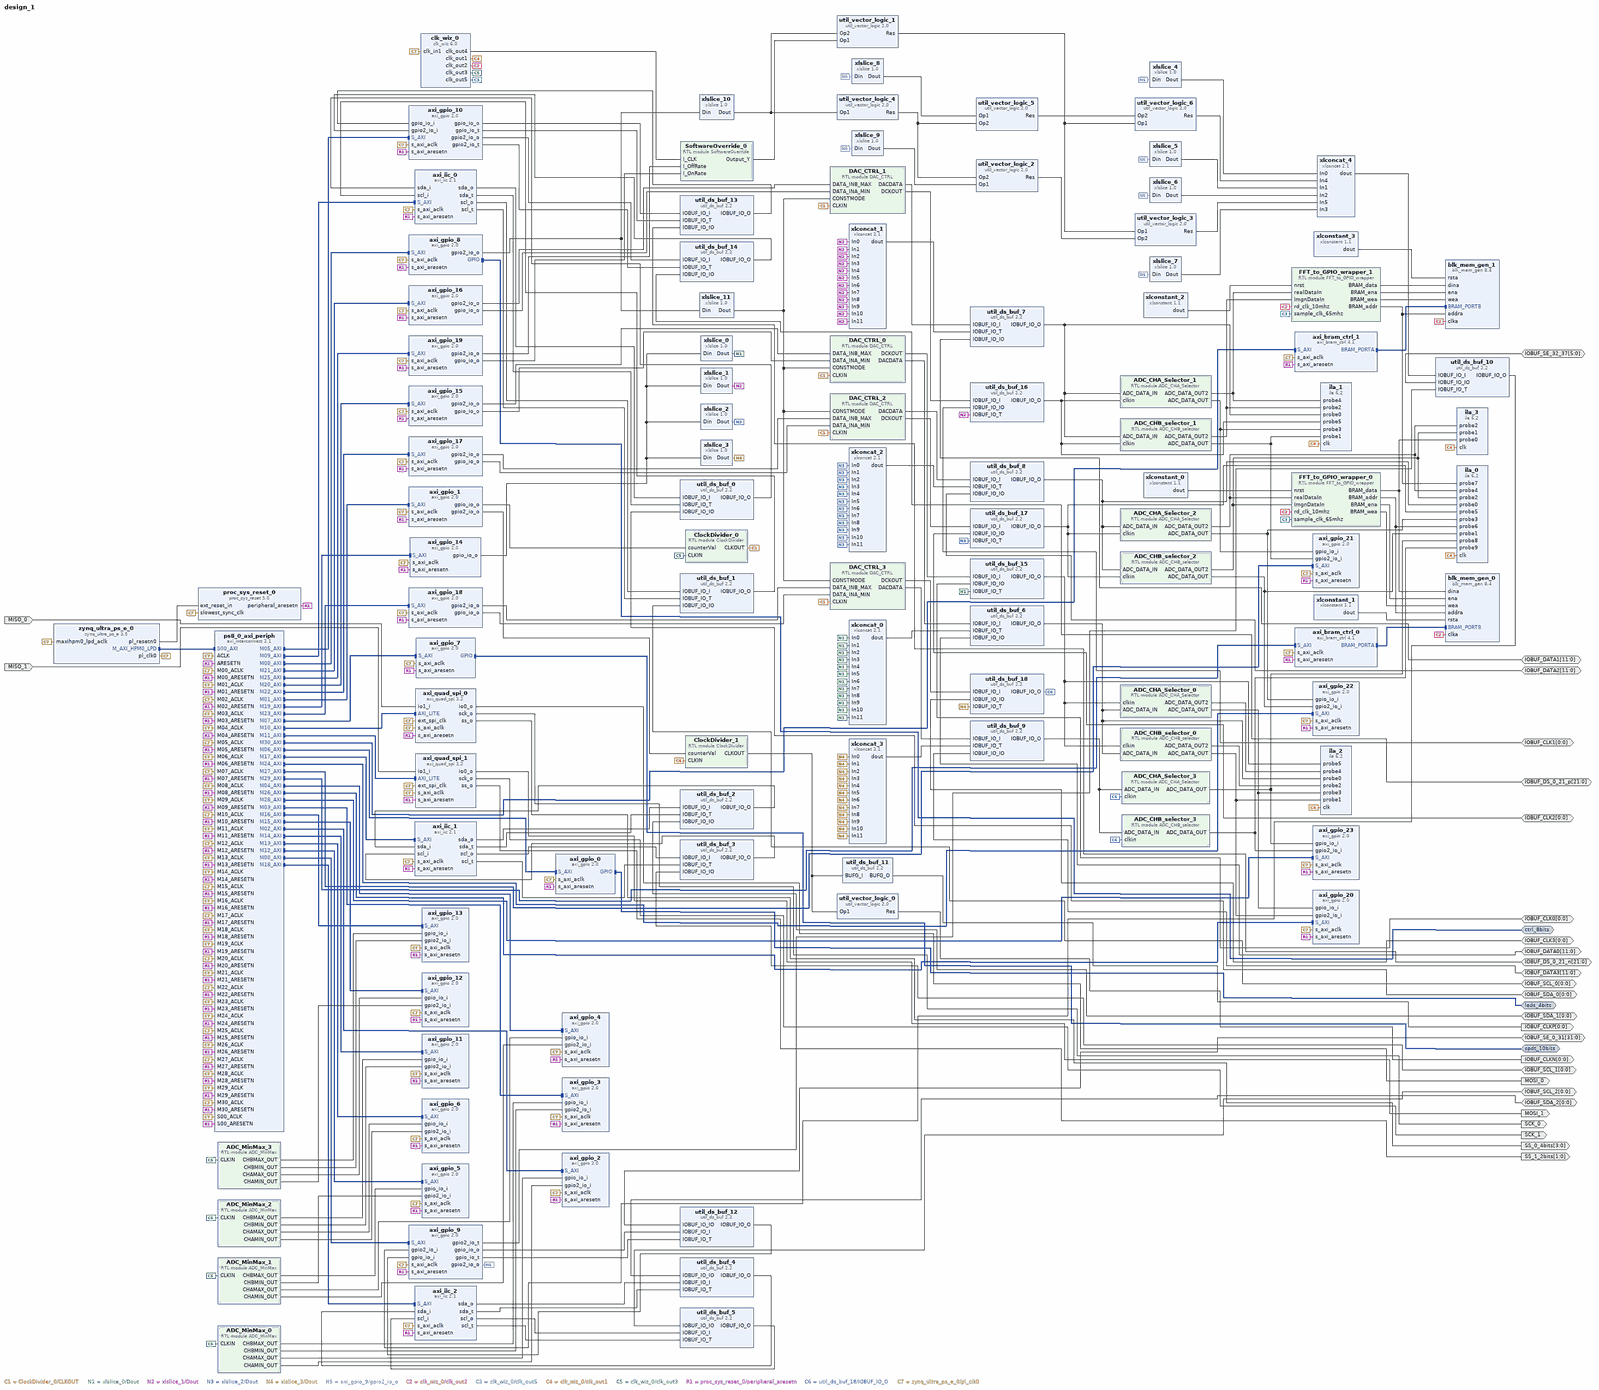
[diagram p0: block diagram of the top level, whole]
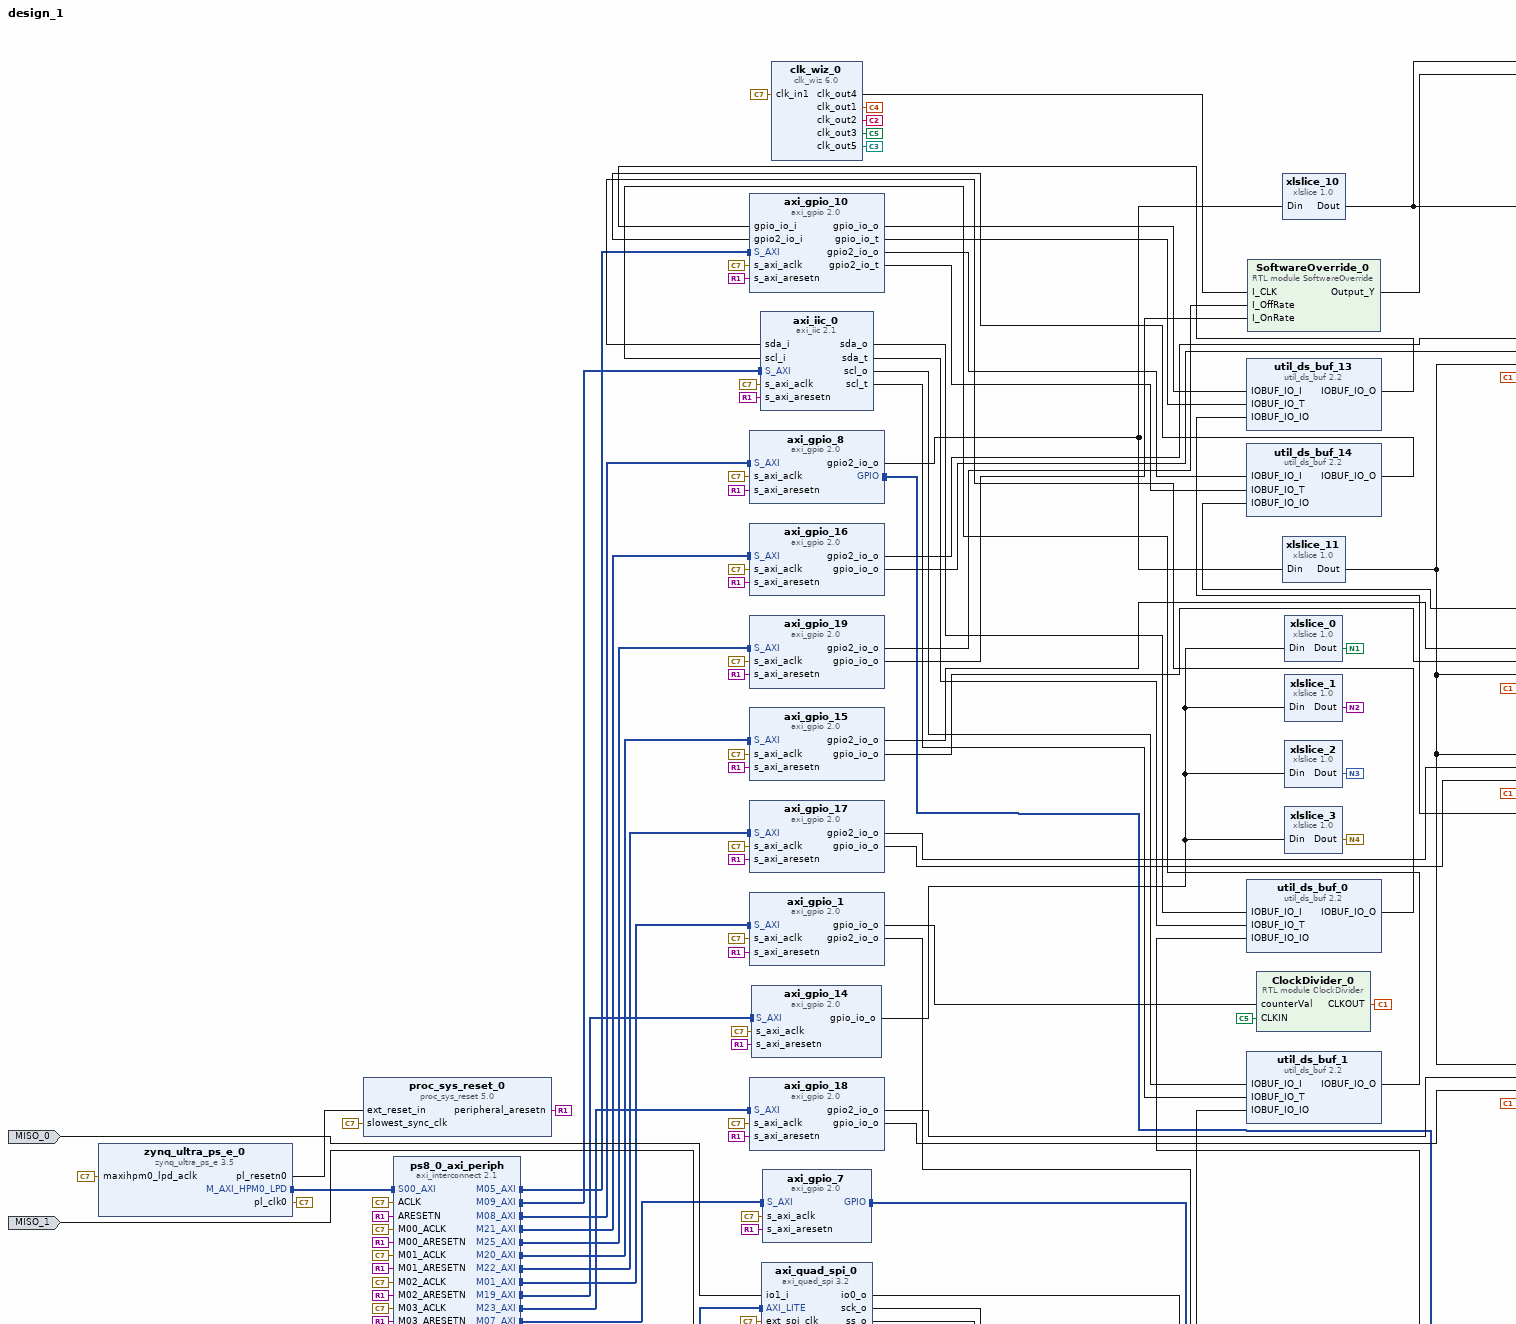
[diagram p1: block diagram of the top level, upper left part]
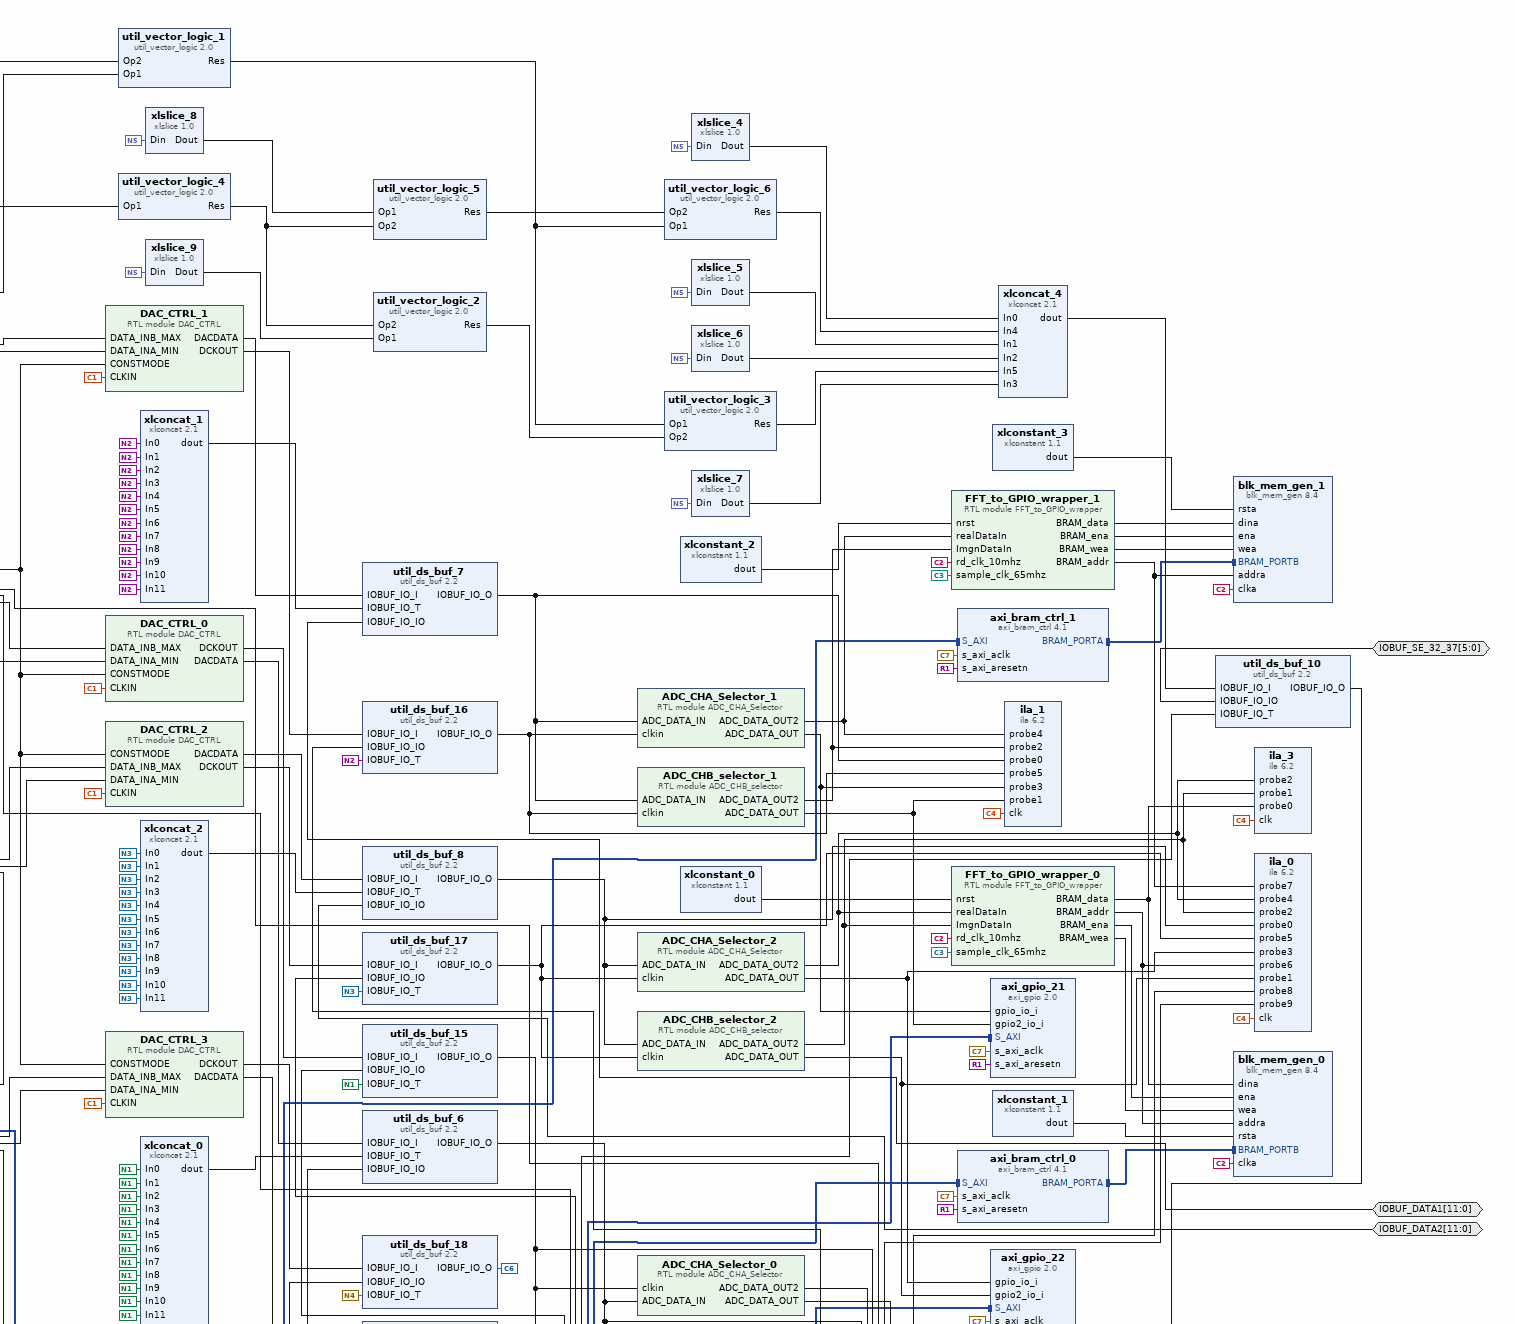
[diagram p2: block diagram of the top level, upper right part]
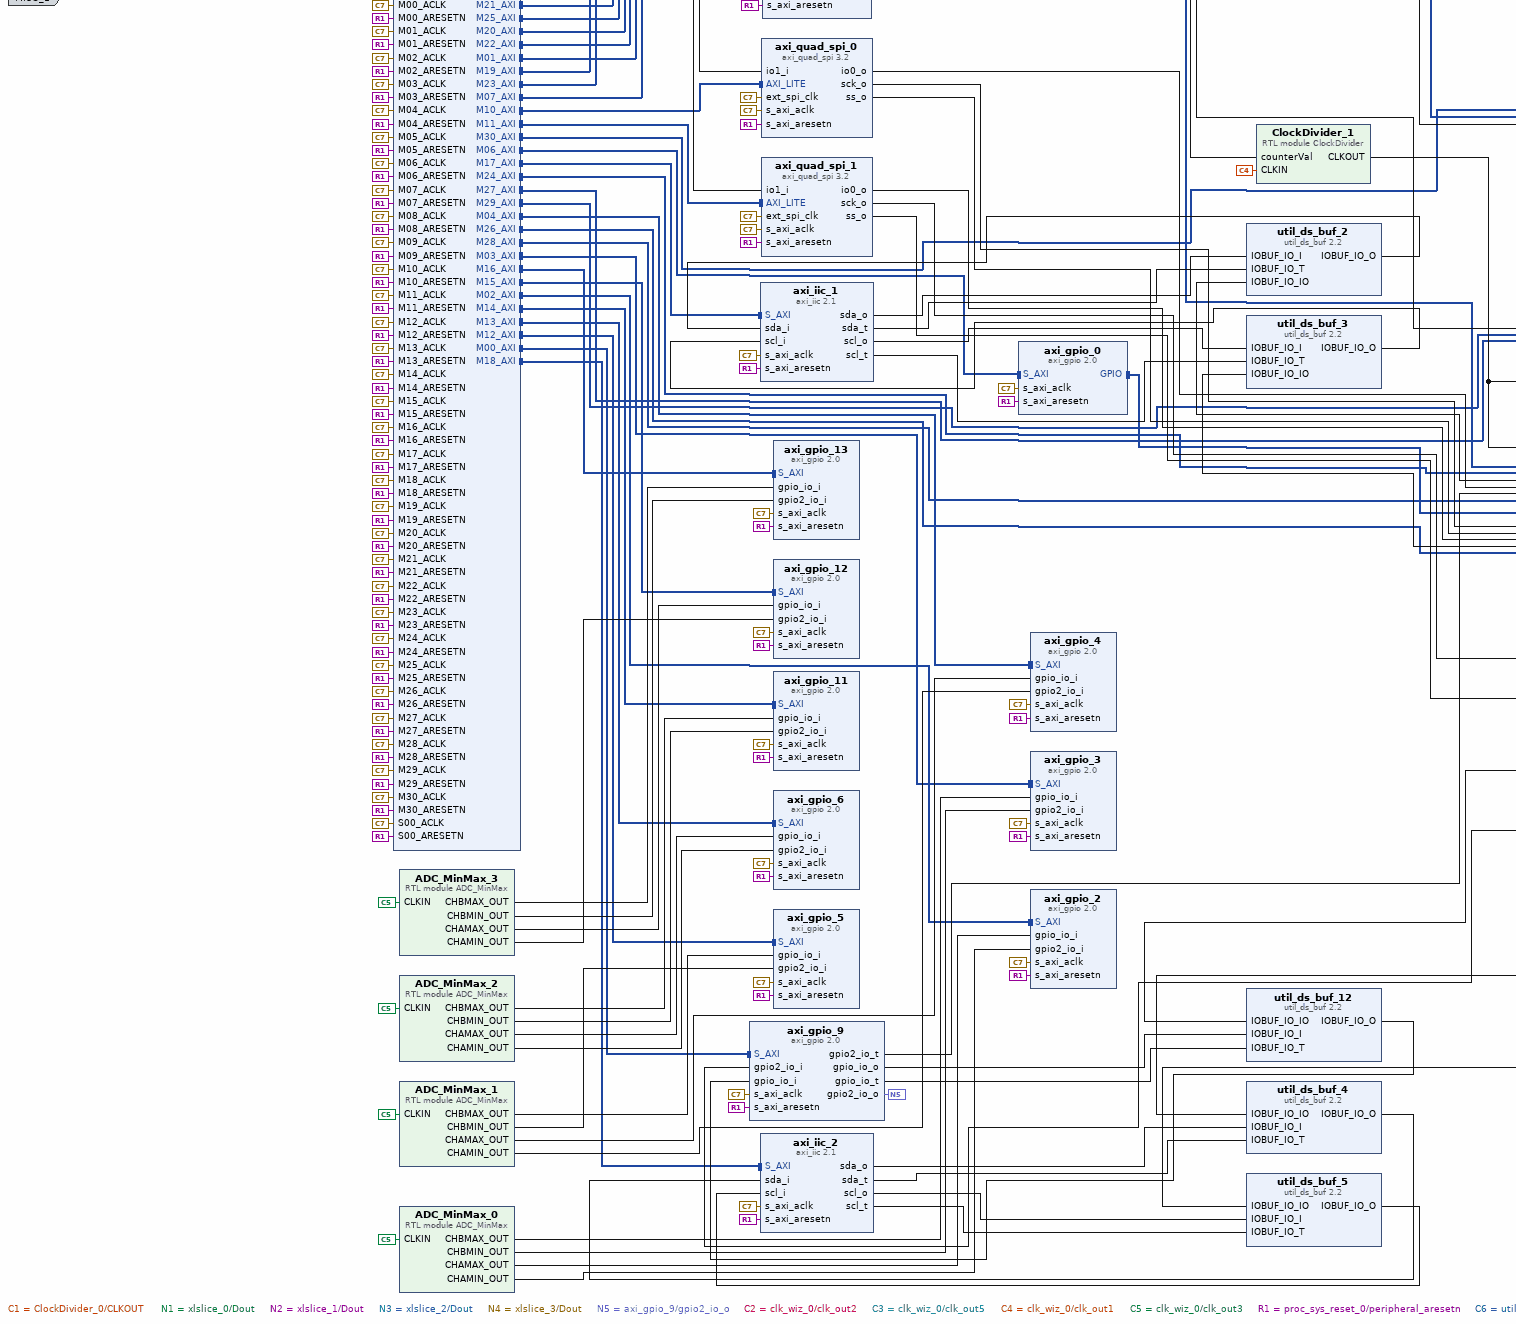
[diagram p3: block diagram of the top level, lower left part]
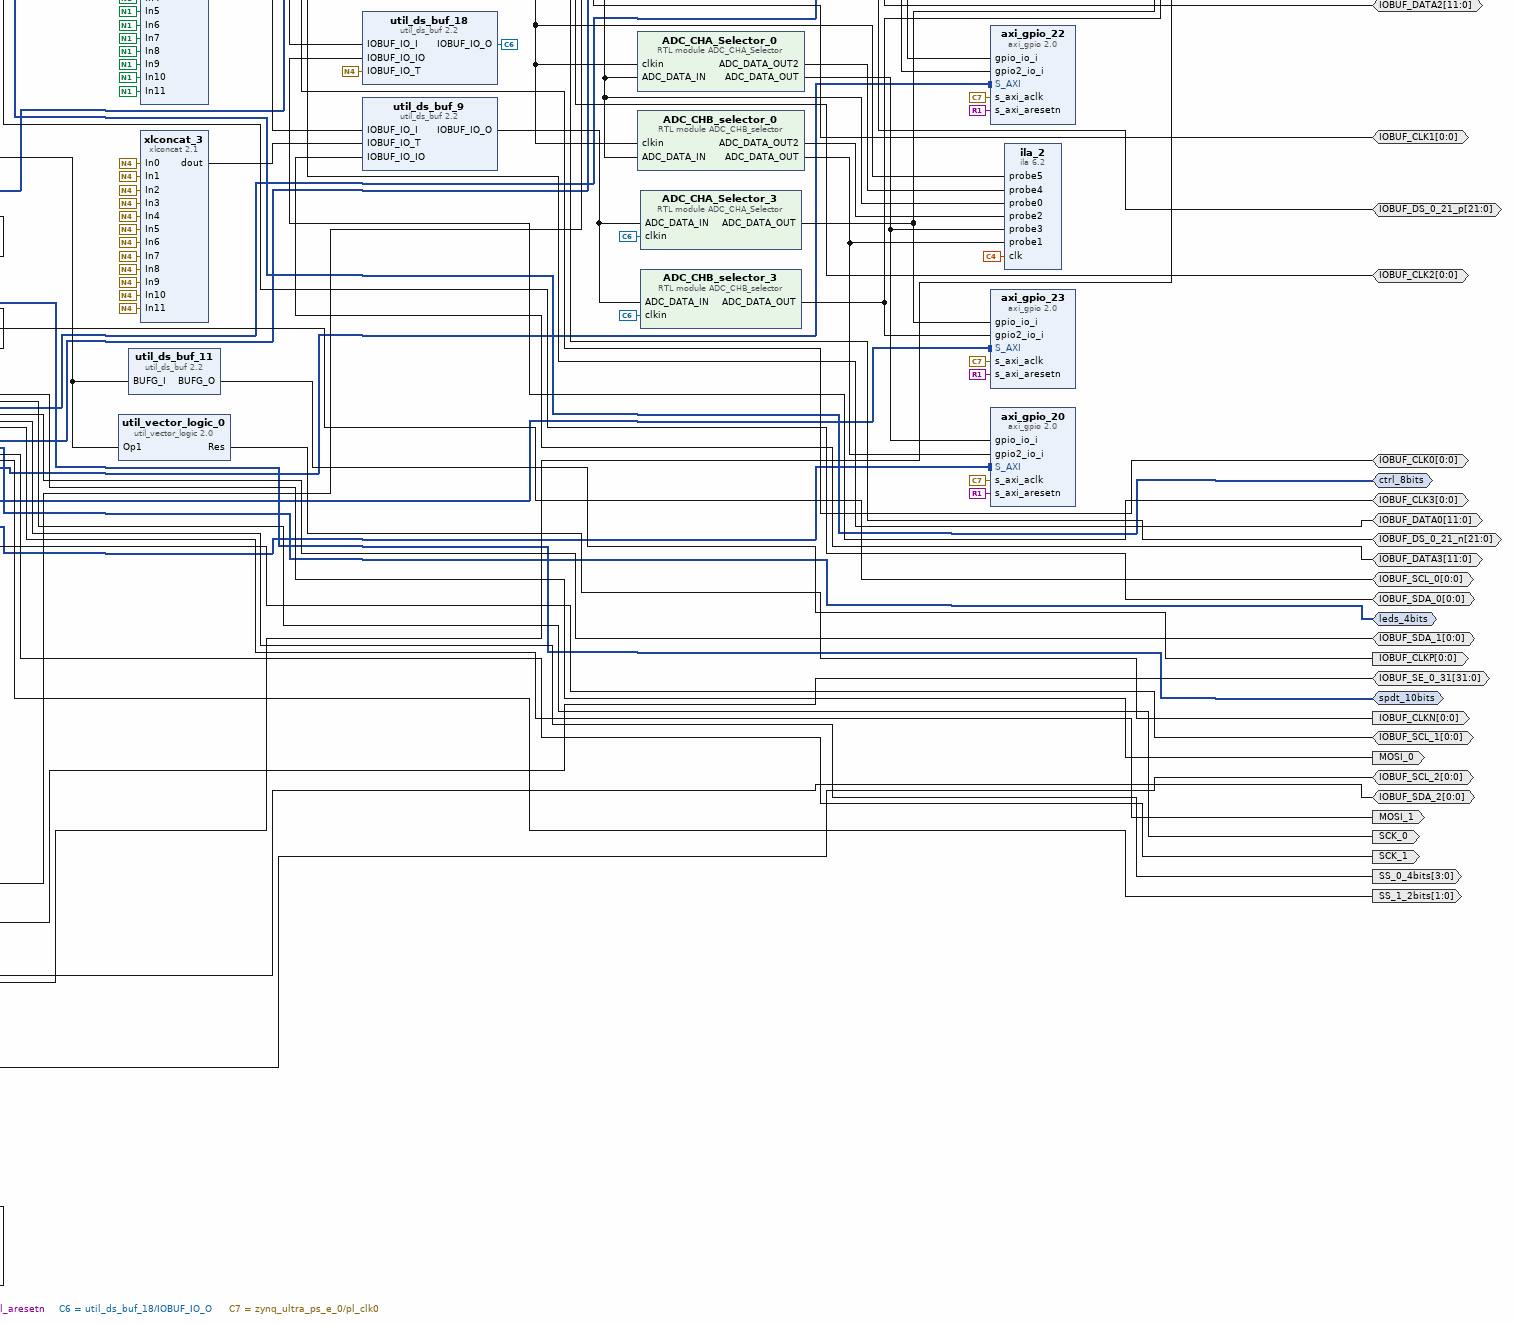
[diagram p4: block diagram of the top level, lower right part]
# Vivado block design design_1, xczu3eg-sfvc784-1-e, Vivado 2023.1
create_bd_design design_1

create_bd_intf_port -mode Master -vlnv xilinx.com:interface:gpio_rtl:1.0 ctrl_8bits
create_bd_intf_port -mode Master -vlnv xilinx.com:interface:gpio_rtl:1.0 leds_4bits
create_bd_intf_port -mode Master -vlnv xilinx.com:interface:gpio_rtl:1.0 spdt_10bits
create_bd_port -dir IO -from 5 -to 0 IOBUF_SE_32_37
create_bd_port -dir IO -from 31 -to 0 IOBUF_SE_0_31
create_bd_port -dir IO -from 21 -to 0 IOBUF_DS_0_21_p
create_bd_port -dir IO -from 21 -to 0 IOBUF_DS_0_21_n
create_bd_port -dir IO -from 0 -to 0 IOBUF_SDA_0
create_bd_port -dir IO -from 0 -to 0 IOBUF_SCL_0
create_bd_port -dir O MOSI_0
create_bd_port -dir I MISO_0
create_bd_port -dir O SCK_0
create_bd_port -dir O -from 3 -to 0 SS_0_4bits
create_bd_port -dir O MOSI_1
create_bd_port -dir I MISO_1
create_bd_port -dir O SCK_1
create_bd_port -dir O -from 1 -to 0 SS_1_2bits
create_bd_port -dir O -from 0 -to 0 IOBUF_CLKN
create_bd_port -dir O -from 0 -to 0 -type clk IOBUF_CLKP
create_bd_port -dir IO -from 0 -to 0 IOBUF_SCL_1
create_bd_port -dir IO -from 0 -to 0 IOBUF_SDA_1
create_bd_port -dir IO -from 0 -to 0 IOBUF_SCL_2
create_bd_port -dir IO -from 0 -to 0 IOBUF_SDA_2
create_bd_port -dir IO -from 0 -to 0 IOBUF_CLK3
create_bd_port -dir IO -from 11 -to 0 IOBUF_DATA1
create_bd_port -dir IO -from 0 -to 0 IOBUF_CLK2
create_bd_port -dir IO -from 0 -to 0 IOBUF_CLK1
create_bd_port -dir IO -from 11 -to 0 IOBUF_DATA2
create_bd_port -dir IO -from 11 -to 0 IOBUF_DATA3
create_bd_port -dir IO -from 0 -to 0 IOBUF_CLK0
create_bd_port -dir IO -from 11 -to 0 IOBUF_DATA0

create_bd_cell -type ip -vlnv xilinx.com:ip:axi_interconnect:2.1 ps8_0_axi_periph
set_property -dict {CONFIG.NUM_MI 31} [get_bd_cells ps8_0_axi_periph]
create_bd_cell -type ip -vlnv xilinx.com:ip:util_vector_logic:2.0 util_vector_logic_0
set_property -dict {CONFIG.C_OPERATION not CONFIG.C_SIZE 1} [get_bd_cells util_vector_logic_0]
create_bd_cell -type ip -vlnv xilinx.com:ip:axi_gpio:2.0 axi_gpio_9
set_property -dict {CONFIG.C_GPIO2_WIDTH 6 CONFIG.C_IS_DUAL 1} [get_bd_cells axi_gpio_9]
create_bd_cell -type ip -vlnv xilinx.com:ip:axi_gpio:2.0 axi_gpio_0
set_property -dict {CONFIG.C_ALL_OUTPUTS 1 CONFIG.C_GPIO_WIDTH 4} [get_bd_cells axi_gpio_0]
create_bd_cell -type ip -vlnv xilinx.com:ip:axi_gpio:2.0 axi_gpio_8
set_property -dict [list \
  CONFIG.C_ALL_OUTPUTS 1 \
  CONFIG.C_ALL_OUTPUTS_2 1 \
  CONFIG.C_GPIO2_WIDTH 2 \
  CONFIG.C_GPIO_WIDTH 8 \
  CONFIG.C_IS_DUAL 1 \
] [get_bd_cells axi_gpio_8]
create_bd_cell -type ip -vlnv xilinx.com:ip:axi_gpio:2.0 axi_gpio_7
set_property -dict {CONFIG.C_ALL_OUTPUTS 1 CONFIG.C_GPIO_WIDTH 10} [get_bd_cells axi_gpio_7]
create_bd_cell -type ip -vlnv xilinx.com:ip:axi_gpio:2.0 axi_gpio_10
set_property -dict {CONFIG.C_GPIO2_WIDTH 22 CONFIG.C_GPIO_WIDTH 22 CONFIG.C_IS_DUAL 1} [get_bd_cells axi_gpio_10]
create_bd_cell -type ip -vlnv xilinx.com:ip:axi_iic:2.1 axi_iic_0
create_bd_cell -type ip -vlnv xilinx.com:ip:axi_quad_spi:3.2 axi_quad_spi_0
set_property -dict {CONFIG.C_NUM_SS_BITS 4 CONFIG.Multiples16 32} [get_bd_cells axi_quad_spi_0]
create_bd_cell -type ip -vlnv xilinx.com:ip:axi_quad_spi:3.2 axi_quad_spi_1
set_property -dict {CONFIG.C_NUM_SS_BITS 2 CONFIG.C_SCK_RATIO 8} [get_bd_cells axi_quad_spi_1]
create_bd_cell -type ip -vlnv xilinx.com:ip:proc_sys_reset:5.0 proc_sys_reset_0
create_bd_cell -type ip -vlnv xilinx.com:ip:util_ds_buf:2.2 util_ds_buf_10
set_property -dict {CONFIG.C_BUF_TYPE IOBUF CONFIG.C_SIZE 6} [get_bd_cells util_ds_buf_10]
create_bd_cell -type ip -vlnv xilinx.com:ip:util_ds_buf:2.2 util_ds_buf_12
set_property -dict {CONFIG.C_BUF_TYPE IOBUF CONFIG.C_SIZE 32} [get_bd_cells util_ds_buf_12]
create_bd_cell -type ip -vlnv xilinx.com:ip:util_ds_buf:2.2 util_ds_buf_14
set_property -dict {CONFIG.C_BUF_TYPE IOBUF CONFIG.C_SIZE 22} [get_bd_cells util_ds_buf_14]
create_bd_cell -type ip -vlnv xilinx.com:ip:util_ds_buf:2.2 util_ds_buf_0
set_property -dict {CONFIG.C_BUF_TYPE IOBUF CONFIG.C_SIZE 1} [get_bd_cells util_ds_buf_0]
create_bd_cell -type ip -vlnv xilinx.com:ip:util_ds_buf:2.2 util_ds_buf_1
set_property -dict {CONFIG.C_BUF_TYPE IOBUF CONFIG.C_SIZE 1} [get_bd_cells util_ds_buf_1]
create_bd_cell -type ip -vlnv xilinx.com:ip:util_ds_buf:2.2 util_ds_buf_13
set_property -dict {CONFIG.C_BUF_TYPE IOBUF CONFIG.C_SIZE 22} [get_bd_cells util_ds_buf_13]
create_bd_cell -type ip -vlnv xilinx.com:ip:zynq_ultra_ps_e:3.5 zynq_ultra_ps_e_0
set_property -dict [list \
  CONFIG.CAN0_BOARD_INTERFACE custom \
  CONFIG.CAN1_BOARD_INTERFACE custom \
  CONFIG.CSU_BOARD_INTERFACE custom \
  CONFIG.DP_BOARD_INTERFACE custom \
  CONFIG.GEM0_BOARD_INTERFACE custom \
  CONFIG.GEM1_BOARD_INTERFACE custom \
  CONFIG.GEM2_BOARD_INTERFACE custom \
  CONFIG.GEM3_BOARD_INTERFACE custom \
  CONFIG.GPIO_BOARD_INTERFACE custom \
  CONFIG.IIC0_BOARD_INTERFACE custom \
  CONFIG.IIC1_BOARD_INTERFACE custom \
  CONFIG.NAND_BOARD_INTERFACE custom \
  CONFIG.PCIE_BOARD_INTERFACE custom \
  CONFIG.PJTAG_BOARD_INTERFACE custom \
  CONFIG.PMU_BOARD_INTERFACE custom \
  CONFIG.PSU_BANK_0_IO_STANDARD LVCMOS18 \
  CONFIG.PSU_BANK_1_IO_STANDARD LVCMOS18 \
  CONFIG.PSU_BANK_2_IO_STANDARD LVCMOS18 \
  CONFIG.PSU_BANK_3_IO_STANDARD LVCMOS18 \
  CONFIG.PSU_USB3__DUAL_CLOCK_ENABLE 0 \
  CONFIG.PSU__CAN1__PERIPHERAL__ENABLE 0 \
  CONFIG.PSU__CRF_APB__ACPU_CTRL__FREQMHZ 1100 \
  CONFIG.PSU__CRF_APB__ACPU_CTRL__SRCSEL APLL \
  CONFIG.PSU__CRF_APB__APLL_CTRL__SRCSEL PSS_REF_CLK \
  CONFIG.PSU__CRF_APB__DBG_FPD_CTRL__FREQMHZ 250 \
  CONFIG.PSU__CRF_APB__DBG_FPD_CTRL__SRCSEL IOPLL \
  CONFIG.PSU__CRF_APB__DBG_TRACE_CTRL__FREQMHZ 250 \
  CONFIG.PSU__CRF_APB__DBG_TRACE_CTRL__SRCSEL IOPLL \
  CONFIG.PSU__CRF_APB__DBG_TSTMP_CTRL__FREQMHZ 250 \
  CONFIG.PSU__CRF_APB__DBG_TSTMP_CTRL__SRCSEL IOPLL \
  CONFIG.PSU__CRF_APB__DDR_CTRL__FREQMHZ 534 \
  CONFIG.PSU__CRF_APB__DDR_CTRL__SRCSEL DPLL \
  CONFIG.PSU__CRF_APB__DPDMA_REF_CTRL__FREQMHZ 550 \
  CONFIG.PSU__CRF_APB__DPDMA_REF_CTRL__SRCSEL APLL \
  CONFIG.PSU__CRF_APB__DPLL_CTRL__SRCSEL PSS_REF_CLK \
  CONFIG.PSU__CRF_APB__DP_AUDIO_REF_CTRL__SRCSEL RPLL \
  CONFIG.PSU__CRF_APB__DP_STC_REF_CTRL__SRCSEL RPLL \
  CONFIG.PSU__CRF_APB__DP_VIDEO_REF_CTRL__SRCSEL VPLL \
  CONFIG.PSU__CRF_APB__GDMA_REF_CTRL__FREQMHZ 550 \
  CONFIG.PSU__CRF_APB__GDMA_REF_CTRL__SRCSEL APLL \
  CONFIG.PSU__CRF_APB__GPU_REF_CTRL__FREQMHZ 500 \
  CONFIG.PSU__CRF_APB__GPU_REF_CTRL__SRCSEL IOPLL \
  CONFIG.PSU__CRF_APB__TOPSW_LSBUS_CTRL__FREQMHZ 100 \
  CONFIG.PSU__CRF_APB__TOPSW_LSBUS_CTRL__SRCSEL IOPLL \
  CONFIG.PSU__CRF_APB__TOPSW_MAIN_CTRL__FREQMHZ 475 \
  CONFIG.PSU__CRF_APB__TOPSW_MAIN_CTRL__SRCSEL DPLL \
  CONFIG.PSU__CRF_APB__VPLL_CTRL__SRCSEL PSS_REF_CLK \
  CONFIG.PSU__CRL_APB__ADMA_REF_CTRL__FREQMHZ 500 \
  CONFIG.PSU__CRL_APB__ADMA_REF_CTRL__SRCSEL IOPLL \
  CONFIG.PSU__CRL_APB__CAN1_REF_CTRL__FREQMHZ 100 \
  CONFIG.PSU__CRL_APB__CAN1_REF_CTRL__SRCSEL IOPLL \
  CONFIG.PSU__CRL_APB__CPU_R5_CTRL__FREQMHZ 500 \
  CONFIG.PSU__CRL_APB__CPU_R5_CTRL__SRCSEL IOPLL \
  CONFIG.PSU__CRL_APB__DBG_LPD_CTRL__FREQMHZ 250 \
  CONFIG.PSU__CRL_APB__DBG_LPD_CTRL__SRCSEL IOPLL \
  CONFIG.PSU__CRL_APB__GEM3_REF_CTRL__FREQMHZ 125 \
  CONFIG.PSU__CRL_APB__GEM3_REF_CTRL__SRCSEL IOPLL \
  CONFIG.PSU__CRL_APB__I2C0_REF_CTRL__FREQMHZ 100 \
  CONFIG.PSU__CRL_APB__I2C0_REF_CTRL__SRCSEL IOPLL \
  CONFIG.PSU__CRL_APB__I2C1_REF_CTRL__FREQMHZ 100 \
  CONFIG.PSU__CRL_APB__I2C1_REF_CTRL__SRCSEL IOPLL \
  CONFIG.PSU__CRL_APB__IOPLL_CTRL__SRCSEL PSS_REF_CLK \
  CONFIG.PSU__CRL_APB__IOU_SWITCH_CTRL__FREQMHZ 250 \
  CONFIG.PSU__CRL_APB__IOU_SWITCH_CTRL__SRCSEL IOPLL \
  CONFIG.PSU__CRL_APB__LPD_LSBUS_CTRL__FREQMHZ 100 \
  CONFIG.PSU__CRL_APB__LPD_LSBUS_CTRL__SRCSEL IOPLL \
  CONFIG.PSU__CRL_APB__LPD_SWITCH_CTRL__FREQMHZ 500 \
  CONFIG.PSU__CRL_APB__LPD_SWITCH_CTRL__SRCSEL IOPLL \
  CONFIG.PSU__CRL_APB__PCAP_CTRL__FREQMHZ 200 \
  CONFIG.PSU__CRL_APB__PCAP_CTRL__SRCSEL RPLL \
  CONFIG.PSU__CRL_APB__PL0_REF_CTRL__FREQMHZ 100 \
  CONFIG.PSU__CRL_APB__PL0_REF_CTRL__SRCSEL IOPLL \
  CONFIG.PSU__CRL_APB__QSPI_REF_CTRL__FREQMHZ 125 \
  CONFIG.PSU__CRL_APB__QSPI_REF_CTRL__SRCSEL IOPLL \
  CONFIG.PSU__CRL_APB__RPLL_CTRL__SRCSEL PSS_REF_CLK \
  CONFIG.PSU__CRL_APB__SDIO1_REF_CTRL__FREQMHZ 200 \
  CONFIG.PSU__CRL_APB__SDIO1_REF_CTRL__SRCSEL RPLL \
  CONFIG.PSU__CRL_APB__TIMESTAMP_REF_CTRL__FREQMHZ 100 \
  CONFIG.PSU__CRL_APB__TIMESTAMP_REF_CTRL__SRCSEL IOPLL \
  CONFIG.PSU__CRL_APB__UART0_REF_CTRL__FREQMHZ 100 \
  CONFIG.PSU__CRL_APB__UART0_REF_CTRL__SRCSEL IOPLL \
  CONFIG.PSU__CRL_APB__UART1_REF_CTRL__FREQMHZ 100 \
  CONFIG.PSU__CRL_APB__UART1_REF_CTRL__SRCSEL IOPLL \
  CONFIG.PSU__CRL_APB__USB0_BUS_REF_CTRL__FREQMHZ 250 \
  CONFIG.PSU__CRL_APB__USB0_BUS_REF_CTRL__SRCSEL IOPLL \
  CONFIG.PSU__CRL_APB__USB3_DUAL_REF_CTRL__FREQMHZ 20 \
  CONFIG.PSU__CRL_APB__USB3_DUAL_REF_CTRL__SRCSEL IOPLL \
  CONFIG.PSU__CRL_APB__USB3__ENABLE 0 \
  CONFIG.PSU__CSUPMU__PERIPHERAL__VALID 0 \
  CONFIG.PSU__DDRC__BUS_WIDTH {32 Bit} \
  CONFIG.PSU__DDRC__DEVICE_CAPACITY {16384 MBits} \
  CONFIG.PSU__DDRC__DRAM_WIDTH {32 Bits} \
  CONFIG.PSU__DDRC__ECC Disabled \
  CONFIG.PSU__DDRC__MEMORY_TYPE {LPDDR 4} \
  CONFIG.PSU__DDRC__SPEED_BIN LPDDR4_1066 \
  CONFIG.PSU__DDR_HIGH_ADDRESS_GUI_ENABLE 0 \
  CONFIG.PSU__DDR__INTERFACE__FREQMHZ 267.000 \
  CONFIG.PSU__DEVICE_TYPE EG \
  CONFIG.PSU__DISPLAYPORT__PERIPHERAL__ENABLE 0 \
  CONFIG.PSU__DLL__ISUSED 1 \
  CONFIG.PSU__ENET3__PERIPHERAL__ENABLE 0 \
  CONFIG.PSU__FPGA_PL0_ENABLE 1 \
  CONFIG.PSU__GPIO0_MIO__IO {MIO 0 .. 25} \
  CONFIG.PSU__GPIO0_MIO__PERIPHERAL__ENABLE 1 \
  CONFIG.PSU__GPIO1_MIO__IO {MIO 26 .. 51} \
  CONFIG.PSU__GPIO1_MIO__PERIPHERAL__ENABLE 1 \
  CONFIG.PSU__I2C0__PERIPHERAL__ENABLE 0 \
  CONFIG.PSU__I2C1__PERIPHERAL__ENABLE 1 \
  CONFIG.PSU__I2C1__PERIPHERAL__IO {MIO 24 .. 25} \
  CONFIG.PSU__IOU_SLCR__IOU_TTC_APB_CLK__TTC0_SEL APB \
  CONFIG.PSU__IOU_SLCR__IOU_TTC_APB_CLK__TTC1_SEL APB \
  CONFIG.PSU__IOU_SLCR__IOU_TTC_APB_CLK__TTC2_SEL APB \
  CONFIG.PSU__IOU_SLCR__IOU_TTC_APB_CLK__TTC3_SEL APB \
  CONFIG.PSU__LPD_SLCR__CSUPMU__FREQMHZ 100 \
  CONFIG.PSU__MAXIGP2__DATA_WIDTH 64 \
  CONFIG.PSU__OVERRIDE_HPX_QOS 0 \
  CONFIG.PSU__OVERRIDE__BASIC_CLOCK 0 \
  CONFIG.PSU__PCIE__CLASS_CODE_BASE 0x06 \
  CONFIG.PSU__PCIE__CLASS_CODE_SUB 0x4 \
  CONFIG.PSU__PCIE__DEVICE_ID 0xD021 \
  CONFIG.PSU__PMU__PERIPHERAL__ENABLE 0 \
  CONFIG.PSU__PRESET_APPLIED 0 \
  CONFIG.PSU__PSS_REF_CLK__FREQMHZ 33.333 \
  CONFIG.PSU__QSPI_COHERENCY 0 \
  CONFIG.PSU__QSPI_ROUTE_THROUGH_FPD 0 \
  CONFIG.PSU__QSPI__GRP_FBCLK__ENABLE 0 \
  CONFIG.PSU__QSPI__PERIPHERAL__DATA_MODE x4 \
  CONFIG.PSU__QSPI__PERIPHERAL__ENABLE 1 \
  CONFIG.PSU__QSPI__PERIPHERAL__IO {MIO 0 .. 5} \
  CONFIG.PSU__QSPI__PERIPHERAL__MODE Single \
  CONFIG.PSU__SATA__PERIPHERAL__ENABLE 0 \
  CONFIG.PSU__SD0__CLK_200_SDR_OTAP_DLY 0x3 \
  CONFIG.PSU__SD0__CLK_50_DDR_ITAP_DLY 0x12 \
  CONFIG.PSU__SD0__CLK_50_DDR_OTAP_DLY 0x6 \
  CONFIG.PSU__SD0__CLK_50_SDR_ITAP_DLY 0x15 \
  CONFIG.PSU__SD0__CLK_50_SDR_OTAP_DLY 0x6 \
  CONFIG.PSU__SD0__DATA_TRANSFER_MODE 8Bit \
  CONFIG.PSU__SD0__PERIPHERAL__ENABLE 1 \
  CONFIG.PSU__SD0__PERIPHERAL__IO {MIO 13 .. 22} \
  CONFIG.PSU__SD0__SLOT_TYPE eMMC \
  CONFIG.PSU__SD1_COHERENCY 0 \
  CONFIG.PSU__SD1_ROUTE_THROUGH_FPD 0 \
  CONFIG.PSU__SD1__CLK_50_SDR_ITAP_DLY 0x15 \
  CONFIG.PSU__SD1__CLK_50_SDR_OTAP_DLY 0x5 \
  CONFIG.PSU__SD1__DATA_TRANSFER_MODE 4Bit \
  CONFIG.PSU__SD1__GRP_CD__ENABLE 1 \
  CONFIG.PSU__SD1__GRP_CD__IO {MIO 45} \
  CONFIG.PSU__SD1__GRP_POW__ENABLE 0 \
  CONFIG.PSU__SD1__GRP_WP__ENABLE 1 \
  CONFIG.PSU__SD1__GRP_WP__IO {MIO 44} \
  CONFIG.PSU__SD1__PERIPHERAL__ENABLE 1 \
  CONFIG.PSU__SD1__PERIPHERAL__IO {MIO 46 .. 51} \
  CONFIG.PSU__SD1__SLOT_TYPE {SD 2.0} \
  CONFIG.PSU__SWDT0__CLOCK__ENABLE 0 \
  CONFIG.PSU__SWDT0__PERIPHERAL__ENABLE 1 \
  CONFIG.PSU__SWDT0__RESET__ENABLE 0 \
  CONFIG.PSU__SWDT1__CLOCK__ENABLE 0 \
  CONFIG.PSU__SWDT1__PERIPHERAL__ENABLE 1 \
  CONFIG.PSU__SWDT1__RESET__ENABLE 0 \
  CONFIG.PSU__TTC0__CLOCK__ENABLE 0 \
  CONFIG.PSU__TTC0__PERIPHERAL__ENABLE 1 \
  CONFIG.PSU__TTC0__WAVEOUT__ENABLE 0 \
  CONFIG.PSU__TTC1__CLOCK__ENABLE 0 \
  CONFIG.PSU__TTC1__PERIPHERAL__ENABLE 1 \
  CONFIG.PSU__TTC1__WAVEOUT__ENABLE 0 \
  CONFIG.PSU__TTC2__CLOCK__ENABLE 0 \
  CONFIG.PSU__TTC2__PERIPHERAL__ENABLE 1 \
  CONFIG.PSU__TTC2__WAVEOUT__ENABLE 0 \
  CONFIG.PSU__TTC3__CLOCK__ENABLE 0 \
  CONFIG.PSU__TTC3__PERIPHERAL__ENABLE 1 \
  CONFIG.PSU__TTC3__WAVEOUT__ENABLE 0 \
  CONFIG.PSU__UART0__BAUD_RATE 115200 \
  CONFIG.PSU__UART0__MODEM__ENABLE 0 \
  CONFIG.PSU__UART0__PERIPHERAL__ENABLE 1 \
  CONFIG.PSU__UART0__PERIPHERAL__IO {MIO 34 .. 35} \
  CONFIG.PSU__UART1__BAUD_RATE 115200 \
  CONFIG.PSU__UART1__MODEM__ENABLE 0 \
  CONFIG.PSU__UART1__PERIPHERAL__ENABLE 1 \
  CONFIG.PSU__UART1__PERIPHERAL__IO {MIO 32 .. 33} \
  CONFIG.PSU__USB0__PERIPHERAL__ENABLE 0 \
  CONFIG.PSU__USE__IRQ0 0 \
  CONFIG.PSU__USE__M_AXI_GP0 0 \
  CONFIG.PSU__USE__M_AXI_GP1 0 \
  CONFIG.PSU__USE__M_AXI_GP2 1 \
  CONFIG.QSPI_BOARD_INTERFACE custom \
  CONFIG.SATA_BOARD_INTERFACE custom \
  CONFIG.SD0_BOARD_INTERFACE custom \
  CONFIG.SD1_BOARD_INTERFACE custom \
  CONFIG.SPI0_BOARD_INTERFACE custom \
  CONFIG.SPI1_BOARD_INTERFACE custom \
  CONFIG.SUBPRESET1 Custom \
  CONFIG.SUBPRESET2 Custom \
  CONFIG.SWDT0_BOARD_INTERFACE custom \
  CONFIG.SWDT1_BOARD_INTERFACE custom \
  CONFIG.TRACE_BOARD_INTERFACE custom \
  CONFIG.TTC0_BOARD_INTERFACE custom \
  CONFIG.TTC1_BOARD_INTERFACE custom \
  CONFIG.TTC2_BOARD_INTERFACE custom \
  CONFIG.TTC3_BOARD_INTERFACE custom \
  CONFIG.UART0_BOARD_INTERFACE custom \
  CONFIG.UART1_BOARD_INTERFACE custom \
  CONFIG.USB0_BOARD_INTERFACE custom \
  CONFIG.USB1_BOARD_INTERFACE custom \
  CONFIG.preset None \
] [get_bd_cells zynq_ultra_ps_e_0]
# 810 more settings of zynq_ultra_ps_e_0 are not shown: defaults, MIO pin electricals, DDR timing, and values the tool derives
create_bd_cell -type ip -vlnv xilinx.com:ip:axi_gpio:2.0 axi_gpio_1
set_property -dict [list \
  CONFIG.C_ALL_OUTPUTS 1 \
  CONFIG.C_ALL_OUTPUTS_2 1 \
  CONFIG.C_GPIO2_WIDTH 28 \
  CONFIG.C_GPIO_WIDTH 28 \
  CONFIG.C_IS_DUAL 1 \
] [get_bd_cells axi_gpio_1]
create_bd_cell -type module -reference ClockDivider ClockDivider_0
create_bd_cell -type ip -vlnv xilinx.com:ip:axi_gpio:2.0 axi_gpio_2
set_property -dict [list \
  CONFIG.C_ALL_INPUTS 1 \
  CONFIG.C_ALL_INPUTS_2 1 \
  CONFIG.C_GPIO2_WIDTH 12 \
  CONFIG.C_GPIO_WIDTH 12 \
  CONFIG.C_IS_DUAL 1 \
] [get_bd_cells axi_gpio_2]
create_bd_cell -type ip -vlnv xilinx.com:ip:axi_gpio:2.0 axi_gpio_3
set_property -dict [list \
  CONFIG.C_ALL_INPUTS 1 \
  CONFIG.C_ALL_INPUTS_2 1 \
  CONFIG.C_GPIO2_WIDTH 12 \
  CONFIG.C_GPIO_WIDTH 12 \
  CONFIG.C_IS_DUAL 1 \
] [get_bd_cells axi_gpio_3]
create_bd_cell -type ip -vlnv xilinx.com:ip:axi_gpio:2.0 axi_gpio_4
set_property -dict [list \
  CONFIG.C_ALL_INPUTS 1 \
  CONFIG.C_ALL_INPUTS_2 1 \
  CONFIG.C_GPIO2_WIDTH 12 \
  CONFIG.C_GPIO_WIDTH 12 \
  CONFIG.C_IS_DUAL 1 \
] [get_bd_cells axi_gpio_4]
create_bd_cell -type ip -vlnv xilinx.com:ip:axi_gpio:2.0 axi_gpio_5
set_property -dict [list \
  CONFIG.C_ALL_INPUTS 1 \
  CONFIG.C_ALL_INPUTS_2 1 \
  CONFIG.C_GPIO2_WIDTH 12 \
  CONFIG.C_GPIO_WIDTH 12 \
  CONFIG.C_IS_DUAL 1 \
] [get_bd_cells axi_gpio_5]
create_bd_cell -type ip -vlnv xilinx.com:ip:axi_gpio:2.0 axi_gpio_6
set_property -dict [list \
  CONFIG.C_ALL_INPUTS 1 \
  CONFIG.C_ALL_INPUTS_2 1 \
  CONFIG.C_GPIO2_WIDTH 12 \
  CONFIG.C_GPIO_WIDTH 12 \
  CONFIG.C_IS_DUAL 1 \
] [get_bd_cells axi_gpio_6]
create_bd_cell -type ip -vlnv xilinx.com:ip:axi_gpio:2.0 axi_gpio_11
set_property -dict [list \
  CONFIG.C_ALL_INPUTS 1 \
  CONFIG.C_ALL_INPUTS_2 1 \
  CONFIG.C_GPIO2_WIDTH 12 \
  CONFIG.C_GPIO_WIDTH 12 \
  CONFIG.C_IS_DUAL 1 \
] [get_bd_cells axi_gpio_11]
create_bd_cell -type ip -vlnv xilinx.com:ip:axi_gpio:2.0 axi_gpio_12
set_property -dict [list \
  CONFIG.C_ALL_INPUTS 1 \
  CONFIG.C_ALL_INPUTS_2 1 \
  CONFIG.C_GPIO2_WIDTH 12 \
  CONFIG.C_GPIO_WIDTH 12 \
  CONFIG.C_IS_DUAL 1 \
] [get_bd_cells axi_gpio_12]
create_bd_cell -type ip -vlnv xilinx.com:ip:axi_gpio:2.0 axi_gpio_13
set_property -dict [list \
  CONFIG.C_ALL_INPUTS 1 \
  CONFIG.C_ALL_INPUTS_2 1 \
  CONFIG.C_GPIO2_WIDTH 12 \
  CONFIG.C_GPIO_WIDTH 12 \
  CONFIG.C_IS_DUAL 1 \
] [get_bd_cells axi_gpio_13]
create_bd_cell -type module -reference ADC_MinMax ADC_MinMax_0
create_bd_cell -type module -reference ADC_MinMax ADC_MinMax_1
create_bd_cell -type module -reference ADC_MinMax ADC_MinMax_2
create_bd_cell -type module -reference ADC_MinMax ADC_MinMax_3
create_bd_cell -type ip -vlnv xilinx.com:ip:axi_iic:2.1 axi_iic_1
create_bd_cell -type ip -vlnv xilinx.com:ip:util_ds_buf:2.2 util_ds_buf_2
set_property -dict {CONFIG.C_BUF_TYPE IOBUF CONFIG.C_SIZE 1} [get_bd_cells util_ds_buf_2]
create_bd_cell -type ip -vlnv xilinx.com:ip:util_ds_buf:2.2 util_ds_buf_3
set_property -dict {CONFIG.C_BUF_TYPE IOBUF CONFIG.C_SIZE 1} [get_bd_cells util_ds_buf_3]
create_bd_cell -type ip -vlnv xilinx.com:ip:axi_iic:2.1 axi_iic_2
create_bd_cell -type ip -vlnv xilinx.com:ip:util_ds_buf:2.2 util_ds_buf_4
set_property -dict {CONFIG.C_BUF_TYPE IOBUF CONFIG.C_SIZE 1} [get_bd_cells util_ds_buf_4]
create_bd_cell -type ip -vlnv xilinx.com:ip:util_ds_buf:2.2 util_ds_buf_5
set_property -dict {CONFIG.C_BUF_TYPE IOBUF CONFIG.C_SIZE 1} [get_bd_cells util_ds_buf_5]
create_bd_cell -type ip -vlnv xilinx.com:ip:util_ds_buf:2.2 util_ds_buf_6
set_property -dict {CONFIG.C_BUF_TYPE IOBUF CONFIG.C_SIZE 12} [get_bd_cells util_ds_buf_6]
create_bd_cell -type ip -vlnv xilinx.com:ip:util_ds_buf:2.2 util_ds_buf_7
set_property -dict {CONFIG.C_BUF_TYPE IOBUF CONFIG.C_SIZE 12} [get_bd_cells util_ds_buf_7]
create_bd_cell -type ip -vlnv xilinx.com:ip:util_ds_buf:2.2 util_ds_buf_8
set_property -dict {CONFIG.C_BUF_TYPE IOBUF CONFIG.C_SIZE 12} [get_bd_cells util_ds_buf_8]
create_bd_cell -type ip -vlnv xilinx.com:ip:util_ds_buf:2.2 util_ds_buf_9
set_property -dict {CONFIG.C_BUF_TYPE IOBUF CONFIG.C_SIZE 12} [get_bd_cells util_ds_buf_9]
create_bd_cell -type ip -vlnv xilinx.com:ip:util_ds_buf:2.2 util_ds_buf_15
set_property -dict {CONFIG.C_BUF_TYPE IOBUF CONFIG.C_SIZE 1} [get_bd_cells util_ds_buf_15]
create_bd_cell -type ip -vlnv xilinx.com:ip:util_ds_buf:2.2 util_ds_buf_16
set_property -dict {CONFIG.C_BUF_TYPE IOBUF CONFIG.C_SIZE 1} [get_bd_cells util_ds_buf_16]
create_bd_cell -type ip -vlnv xilinx.com:ip:util_ds_buf:2.2 util_ds_buf_17
set_property -dict {CONFIG.C_BUF_TYPE IOBUF CONFIG.C_SIZE 1} [get_bd_cells util_ds_buf_17]
create_bd_cell -type ip -vlnv xilinx.com:ip:util_ds_buf:2.2 util_ds_buf_18
set_property -dict {CONFIG.C_BUF_TYPE IOBUF CONFIG.C_SIZE 1} [get_bd_cells util_ds_buf_18]
create_bd_cell -type ip -vlnv xilinx.com:ip:xlconcat:2.1 xlconcat_0
set_property -dict {CONFIG.NUM_PORTS 12} [get_bd_cells xlconcat_0]
create_bd_cell -type ip -vlnv xilinx.com:ip:xlconcat:2.1 xlconcat_1
set_property -dict {CONFIG.NUM_PORTS 12} [get_bd_cells xlconcat_1]
create_bd_cell -type ip -vlnv xilinx.com:ip:xlconcat:2.1 xlconcat_2
set_property -dict {CONFIG.NUM_PORTS 12} [get_bd_cells xlconcat_2]
create_bd_cell -type ip -vlnv xilinx.com:ip:xlconcat:2.1 xlconcat_3
set_property -dict {CONFIG.NUM_PORTS 12} [get_bd_cells xlconcat_3]
create_bd_cell -type ip -vlnv xilinx.com:ip:axi_gpio:2.0 axi_gpio_14
set_property -dict {CONFIG.C_ALL_OUTPUTS 1 CONFIG.C_GPIO_WIDTH 4} [get_bd_cells axi_gpio_14]
create_bd_cell -type ip -vlnv xilinx.com:ip:xlslice:1.0 xlslice_0
set_property -dict {CONFIG.DIN_FROM 3 CONFIG.DIN_TO 3 CONFIG.DIN_WIDTH 4 CONFIG.DOUT_WIDTH 1} [get_bd_cells xlslice_0]
create_bd_cell -type ip -vlnv xilinx.com:ip:xlslice:1.0 xlslice_1
set_property -dict {CONFIG.DIN_FROM 2 CONFIG.DIN_TO 2 CONFIG.DIN_WIDTH 4 CONFIG.DOUT_WIDTH 1} [get_bd_cells xlslice_1]
create_bd_cell -type ip -vlnv xilinx.com:ip:xlslice:1.0 xlslice_2
set_property -dict {CONFIG.DIN_FROM 1 CONFIG.DIN_TO 1 CONFIG.DIN_WIDTH 4 CONFIG.DOUT_WIDTH 1} [get_bd_cells xlslice_2]
create_bd_cell -type ip -vlnv xilinx.com:ip:xlslice:1.0 xlslice_3
set_property -dict {CONFIG.DIN_FROM 0 CONFIG.DIN_TO 0 CONFIG.DIN_WIDTH 4 CONFIG.DOUT_WIDTH 1} [get_bd_cells xlslice_3]
create_bd_cell -type ip -vlnv xilinx.com:ip:axi_gpio:2.0 axi_gpio_15
set_property -dict [list \
  CONFIG.C_ALL_INPUTS 0 \
  CONFIG.C_ALL_INPUTS_2 0 \
  CONFIG.C_ALL_OUTPUTS 1 \
  CONFIG.C_ALL_OUTPUTS_2 1 \
  CONFIG.C_GPIO2_WIDTH 12 \
  CONFIG.C_GPIO_WIDTH 12 \
  CONFIG.C_IS_DUAL 1 \
] [get_bd_cells axi_gpio_15]
create_bd_cell -type ip -vlnv xilinx.com:ip:axi_gpio:2.0 axi_gpio_16
set_property -dict [list \
  CONFIG.C_ALL_INPUTS 0 \
  CONFIG.C_ALL_INPUTS_2 0 \
  CONFIG.C_ALL_OUTPUTS 1 \
  CONFIG.C_ALL_OUTPUTS_2 1 \
  CONFIG.C_GPIO2_WIDTH 12 \
  CONFIG.C_GPIO_WIDTH 12 \
  CONFIG.C_IS_DUAL 1 \
] [get_bd_cells axi_gpio_16]
create_bd_cell -type ip -vlnv xilinx.com:ip:axi_gpio:2.0 axi_gpio_17
set_property -dict [list \
  CONFIG.C_ALL_INPUTS 0 \
  CONFIG.C_ALL_INPUTS_2 0 \
  CONFIG.C_ALL_OUTPUTS 1 \
  CONFIG.C_ALL_OUTPUTS_2 1 \
  CONFIG.C_GPIO2_WIDTH 12 \
  CONFIG.C_GPIO_WIDTH 12 \
  CONFIG.C_IS_DUAL 1 \
] [get_bd_cells axi_gpio_17]
create_bd_cell -type ip -vlnv xilinx.com:ip:axi_gpio:2.0 axi_gpio_18
set_property -dict [list \
  CONFIG.C_ALL_INPUTS 0 \
  CONFIG.C_ALL_INPUTS_2 0 \
  CONFIG.C_ALL_OUTPUTS 1 \
  CONFIG.C_ALL_OUTPUTS_2 1 \
  CONFIG.C_GPIO2_WIDTH 12 \
  CONFIG.C_GPIO_WIDTH 12 \
  CONFIG.C_IS_DUAL 1 \
] [get_bd_cells axi_gpio_18]
create_bd_cell -type module -reference ClockDivider ClockDivider_1
create_bd_cell -type ip -vlnv xilinx.com:ip:ila:6.2 ila_0
set_property -dict [list \
  CONFIG.C_DATA_DEPTH 4096 \
  CONFIG.C_MONITOR_TYPE Native \
  CONFIG.C_NUM_OF_PROBES 10 \
  CONFIG.C_PROBE0_WIDTH 12 \
  CONFIG.C_PROBE1_WIDTH 12 \
  CONFIG.C_PROBE2_WIDTH 12 \
  CONFIG.C_PROBE3_WIDTH 12 \
  CONFIG.C_PROBE4_WIDTH 12 \
  CONFIG.C_PROBE5_WIDTH 1 \
  CONFIG.C_PROBE6_WIDTH 31 \
  CONFIG.C_PROBE7_WIDTH 31 \
  CONFIG.C_PROBE8_WIDTH 12 \
  CONFIG.C_PROBE9_WIDTH 12 \
] [get_bd_cells ila_0]
create_bd_cell -type module -reference DAC_CTRL DAC_CTRL_0
create_bd_cell -type module -reference DAC_CTRL DAC_CTRL_1
create_bd_cell -type module -reference DAC_CTRL DAC_CTRL_2
create_bd_cell -type module -reference DAC_CTRL DAC_CTRL_3
create_bd_cell -type ip -vlnv xilinx.com:ip:xlconcat:2.1 xlconcat_4
set_property -dict {CONFIG.NUM_PORTS 6} [get_bd_cells xlconcat_4]
create_bd_cell -type ip -vlnv xilinx.com:ip:xlslice:1.0 xlslice_4
set_property -dict {CONFIG.DIN_WIDTH 6} [get_bd_cells xlslice_4]
create_bd_cell -type ip -vlnv xilinx.com:ip:xlslice:1.0 xlslice_5
set_property -dict {CONFIG.DIN_FROM 1 CONFIG.DIN_TO 1 CONFIG.DIN_WIDTH 6} [get_bd_cells xlslice_5]
create_bd_cell -type ip -vlnv xilinx.com:ip:xlslice:1.0 xlslice_6
set_property -dict {CONFIG.DIN_FROM 2 CONFIG.DIN_TO 2 CONFIG.DIN_WIDTH 6} [get_bd_cells xlslice_6]
create_bd_cell -type ip -vlnv xilinx.com:ip:xlslice:1.0 xlslice_7
set_property -dict {CONFIG.DIN_FROM 3 CONFIG.DIN_TO 3 CONFIG.DIN_WIDTH 6} [get_bd_cells xlslice_7]
create_bd_cell -type ip -vlnv xilinx.com:ip:xlslice:1.0 xlslice_8
set_property -dict {CONFIG.DIN_FROM 4 CONFIG.DIN_TO 4 CONFIG.DIN_WIDTH 6} [get_bd_cells xlslice_8]
create_bd_cell -type ip -vlnv xilinx.com:ip:xlslice:1.0 xlslice_9
set_property -dict {CONFIG.DIN_FROM 5 CONFIG.DIN_TO 5 CONFIG.DIN_WIDTH 6} [get_bd_cells xlslice_9]
create_bd_cell -type ip -vlnv xilinx.com:ip:util_vector_logic:2.0 util_vector_logic_1
set_property -dict {CONFIG.C_SIZE 1} [get_bd_cells util_vector_logic_1]
create_bd_cell -type ip -vlnv xilinx.com:ip:util_vector_logic:2.0 util_vector_logic_2
set_property -dict {CONFIG.C_SIZE 1} [get_bd_cells util_vector_logic_2]
create_bd_cell -type ip -vlnv xilinx.com:ip:util_vector_logic:2.0 util_vector_logic_3
set_property -dict {CONFIG.C_OPERATION or CONFIG.C_SIZE 1} [get_bd_cells util_vector_logic_3]
create_bd_cell -type ip -vlnv xilinx.com:ip:util_vector_logic:2.0 util_vector_logic_4
set_property -dict {CONFIG.C_OPERATION not CONFIG.C_SIZE 1} [get_bd_cells util_vector_logic_4]
create_bd_cell -type ip -vlnv xilinx.com:ip:xlslice:1.0 xlslice_10
set_property -dict {CONFIG.DIN_FROM 1 CONFIG.DIN_TO 1 CONFIG.DIN_WIDTH 2} [get_bd_cells xlslice_10]
create_bd_cell -type ip -vlnv xilinx.com:ip:xlslice:1.0 xlslice_11
set_property -dict {CONFIG.DIN_FROM 0 CONFIG.DIN_TO 0 CONFIG.DIN_WIDTH 2} [get_bd_cells xlslice_11]
create_bd_cell -type ip -vlnv xilinx.com:ip:util_vector_logic:2.0 util_vector_logic_5
set_property -dict {CONFIG.C_SIZE 1} [get_bd_cells util_vector_logic_5]
create_bd_cell -type ip -vlnv xilinx.com:ip:util_vector_logic:2.0 util_vector_logic_6
set_property -dict {CONFIG.C_OPERATION or CONFIG.C_SIZE 1} [get_bd_cells util_vector_logic_6]
create_bd_cell -type module -reference SoftwareOverride SoftwareOverride_0
create_bd_cell -type ip -vlnv xilinx.com:ip:axi_gpio:2.0 axi_gpio_19
set_property -dict [list \
  CONFIG.C_ALL_OUTPUTS 1 \
  CONFIG.C_ALL_OUTPUTS_2 1 \
  CONFIG.C_GPIO2_WIDTH 32 \
  CONFIG.C_GPIO_WIDTH 32 \
  CONFIG.C_IS_DUAL 1 \
] [get_bd_cells axi_gpio_19]
create_bd_cell -type ip -vlnv xilinx.com:ip:axi_gpio:2.0 axi_gpio_20
set_property -dict [list \
  CONFIG.C_ALL_INPUTS 1 \
  CONFIG.C_ALL_INPUTS_2 1 \
  CONFIG.C_GPIO2_WIDTH 12 \
  CONFIG.C_GPIO_WIDTH 12 \
  CONFIG.C_IS_DUAL 1 \
] [get_bd_cells axi_gpio_20]
create_bd_cell -type ip -vlnv xilinx.com:ip:axi_gpio:2.0 axi_gpio_21
set_property -dict [list \
  CONFIG.C_ALL_INPUTS 1 \
  CONFIG.C_ALL_INPUTS_2 1 \
  CONFIG.C_GPIO2_WIDTH 12 \
  CONFIG.C_GPIO_WIDTH 12 \
  CONFIG.C_IS_DUAL 1 \
] [get_bd_cells axi_gpio_21]
create_bd_cell -type ip -vlnv xilinx.com:ip:axi_gpio:2.0 axi_gpio_22
set_property -dict [list \
  CONFIG.C_ALL_INPUTS 1 \
  CONFIG.C_ALL_INPUTS_2 1 \
  CONFIG.C_GPIO2_WIDTH 12 \
  CONFIG.C_GPIO_WIDTH 12 \
  CONFIG.C_IS_DUAL 1 \
] [get_bd_cells axi_gpio_22]
create_bd_cell -type ip -vlnv xilinx.com:ip:axi_gpio:2.0 axi_gpio_23
set_property -dict [list \
  CONFIG.C_ALL_INPUTS 1 \
  CONFIG.C_ALL_INPUTS_2 1 \
  CONFIG.C_GPIO2_WIDTH 12 \
  CONFIG.C_GPIO_WIDTH 12 \
  CONFIG.C_IS_DUAL 1 \
] [get_bd_cells axi_gpio_23]
create_bd_cell -type ip -vlnv xilinx.com:ip:xlconstant:1.1 xlconstant_0
create_bd_cell -type ip -vlnv xilinx.com:ip:blk_mem_gen:8.4 blk_mem_gen_0
set_property -dict {CONFIG.Memory_Type True_Dual_Port_RAM} [get_bd_cells blk_mem_gen_0]
create_bd_cell -type ip -vlnv xilinx.com:ip:xlconstant:1.1 xlconstant_1
set_property -dict {CONFIG.CONST_VAL 0} [get_bd_cells xlconstant_1]
create_bd_cell -type module -reference ADC_CHA_Selector ADC_CHA_Selector_0
create_bd_cell -type module -reference ADC_CHA_Selector ADC_CHA_Selector_1
create_bd_cell -type module -reference ADC_CHA_Selector ADC_CHA_Selector_2
create_bd_cell -type module -reference ADC_CHA_Selector ADC_CHA_Selector_3
create_bd_cell -type module -reference ADC_CHB_selector ADC_CHB_selector_0
create_bd_cell -type module -reference ADC_CHB_selector ADC_CHB_selector_1
create_bd_cell -type module -reference ADC_CHB_selector ADC_CHB_selector_2
create_bd_cell -type module -reference ADC_CHB_selector ADC_CHB_selector_3
create_bd_cell -type ip -vlnv xilinx.com:ip:blk_mem_gen:8.4 blk_mem_gen_1
set_property -dict {CONFIG.Memory_Type True_Dual_Port_RAM} [get_bd_cells blk_mem_gen_1]
create_bd_cell -type ip -vlnv xilinx.com:ip:xlconstant:1.1 xlconstant_2
create_bd_cell -type ip -vlnv xilinx.com:ip:xlconstant:1.1 xlconstant_3
set_property -dict {CONFIG.CONST_VAL 0} [get_bd_cells xlconstant_3]
create_bd_cell -type ip -vlnv xilinx.com:ip:ila:6.2 ila_1
set_property -dict [list \
  CONFIG.C_DATA_DEPTH 4096 \
  CONFIG.C_MONITOR_TYPE Native \
  CONFIG.C_NUM_OF_PROBES 6 \
  CONFIG.C_PROBE0_WIDTH 12 \
  CONFIG.C_PROBE1_WIDTH 12 \
  CONFIG.C_PROBE2_WIDTH 12 \
  CONFIG.C_PROBE3_WIDTH 12 \
  CONFIG.C_PROBE4_WIDTH 12 \
  CONFIG.C_PROBE5_WIDTH 1 \
] [get_bd_cells ila_1]
create_bd_cell -type ip -vlnv xilinx.com:ip:ila:6.2 ila_2
set_property -dict [list \
  CONFIG.C_DATA_DEPTH 4096 \
  CONFIG.C_MONITOR_TYPE Native \
  CONFIG.C_NUM_OF_PROBES 6 \
  CONFIG.C_PROBE0_WIDTH 12 \
  CONFIG.C_PROBE1_WIDTH 12 \
  CONFIG.C_PROBE2_WIDTH 12 \
  CONFIG.C_PROBE3_WIDTH 12 \
  CONFIG.C_PROBE4_WIDTH 12 \
  CONFIG.C_PROBE5_WIDTH 1 \
] [get_bd_cells ila_2]
create_bd_cell -type ip -vlnv xilinx.com:ip:ila:6.2 ila_3
set_property -dict [list \
  CONFIG.C_DATA_DEPTH 4096 \
  CONFIG.C_MONITOR_TYPE Native \
  CONFIG.C_NUM_OF_PROBES 3 \
  CONFIG.C_PROBE0_WIDTH 32 \
  CONFIG.C_PROBE1_WIDTH 12 \
  CONFIG.C_PROBE2_WIDTH 12 \
  CONFIG.C_PROBE3_WIDTH 1 \
  CONFIG.C_PROBE4_WIDTH 1 \
  CONFIG.C_PROBE5_WIDTH 1 \
] [get_bd_cells ila_3]
create_bd_cell -type module -reference FFT_to_GPIO_wrapper FFT_to_GPIO_wrapper_0
create_bd_cell -type module -reference FFT_to_GPIO_wrapper FFT_to_GPIO_wrapper_1
create_bd_cell -type ip -vlnv xilinx.com:ip:axi_bram_ctrl:4.1 axi_bram_ctrl_0
set_property -dict {CONFIG.SINGLE_PORT_BRAM 1} [get_bd_cells axi_bram_ctrl_0]
create_bd_cell -type ip -vlnv xilinx.com:ip:axi_bram_ctrl:4.1 axi_bram_ctrl_1
set_property -dict {CONFIG.SINGLE_PORT_BRAM 1} [get_bd_cells axi_bram_ctrl_1]
create_bd_cell -type ip -vlnv xilinx.com:ip:clk_wiz:6.0 clk_wiz_0
set_property -dict [list \
  CONFIG.CLKOUT1_JITTER 204.495 \
  CONFIG.CLKOUT1_PHASE_ERROR 300.282 \
  CONFIG.CLKOUT1_REQUESTED_OUT_FREQ 260 \
  CONFIG.CLKOUT1_REQUESTED_PHASE 10 \
  CONFIG.CLKOUT2_JITTER 339.118 \
  CONFIG.CLKOUT2_PHASE_ERROR 300.282 \
  CONFIG.CLKOUT2_REQUESTED_OUT_FREQ 10 \
  CONFIG.CLKOUT2_REQUESTED_PHASE 0 \
  CONFIG.CLKOUT2_USED true \
  CONFIG.CLKOUT3_JITTER 186.136 \
  CONFIG.CLKOUT3_PHASE_ERROR 300.282 \
  CONFIG.CLKOUT3_REQUESTED_OUT_FREQ 520 \
  CONFIG.CLKOUT3_REQUESTED_PHASE 0 \
  CONFIG.CLKOUT3_USED true \
  CONFIG.CLKOUT4_JITTER 186.136 \
  CONFIG.CLKOUT4_PHASE_ERROR 300.282 \
  CONFIG.CLKOUT4_REQUESTED_OUT_FREQ 520 \
  CONFIG.CLKOUT4_REQUESTED_PHASE 90 \
  CONFIG.CLKOUT4_USED true \
  CONFIG.CLKOUT5_JITTER 247.433 \
  CONFIG.CLKOUT5_PHASE_ERROR 300.282 \
  CONFIG.CLKOUT5_REQUESTED_OUT_FREQ 65 \
  CONFIG.CLKOUT5_USED true \
  CONFIG.JITTER_SEL No_Jitter \
  CONFIG.MMCM_CLKFBOUT_MULT_F 52.000 \
  CONFIG.MMCM_CLKIN1_PERIOD 10.000 \
  CONFIG.MMCM_CLKIN2_PERIOD 10.000 \
  CONFIG.MMCM_CLKOUT0_DIVIDE_F 4.000 \
  CONFIG.MMCM_CLKOUT0_DUTY_CYCLE 0.5 \
  CONFIG.MMCM_CLKOUT0_PHASE 11.250 \
  CONFIG.MMCM_CLKOUT1_DIVIDE 104 \
  CONFIG.MMCM_CLKOUT1_DUTY_CYCLE 0.5 \
  CONFIG.MMCM_CLKOUT1_PHASE 0.000 \
  CONFIG.MMCM_CLKOUT2_DIVIDE 2 \
  CONFIG.MMCM_CLKOUT2_DUTY_CYCLE 0.5 \
  CONFIG.MMCM_CLKOUT2_PHASE 0.000 \
  CONFIG.MMCM_CLKOUT3_DIVIDE 2 \
  CONFIG.MMCM_CLKOUT3_DUTY_CYCLE 0.5 \
  CONFIG.MMCM_CLKOUT3_PHASE 90.000 \
  CONFIG.MMCM_CLKOUT4_DIVIDE 16 \
  CONFIG.MMCM_CLKOUT4_DUTY_CYCLE 0.5 \
  CONFIG.MMCM_DIVCLK_DIVIDE 5 \
  CONFIG.NUM_OUT_CLKS 5 \
  CONFIG.USE_LOCKED false \
  CONFIG.USE_MIN_POWER true \
  CONFIG.USE_RESET false \
] [get_bd_cells clk_wiz_0]
create_bd_cell -type ip -vlnv xilinx.com:ip:util_ds_buf:2.2 util_ds_buf_11
set_property -dict {CONFIG.C_BUF_TYPE BUFG CONFIG.C_SIZE 1} [get_bd_cells util_ds_buf_11]

# ---- connections ----

connect_bd_intf_net [get_bd_intf_pins blk_mem_gen_0/BRAM_PORTB] [get_bd_intf_pins axi_bram_ctrl_0/BRAM_PORTA]
connect_bd_intf_net -intf_net axi_bram_ctrl_0_BRAM_PORTA1 [get_bd_intf_pins blk_mem_gen_1/BRAM_PORTB] [get_bd_intf_pins axi_bram_ctrl_1/BRAM_PORTA]
connect_bd_intf_net [get_bd_intf_ports leds_4bits] [get_bd_intf_pins axi_gpio_0/GPIO]
connect_bd_intf_net [get_bd_intf_ports spdt_10bits] [get_bd_intf_pins axi_gpio_7/GPIO]
connect_bd_intf_net [get_bd_intf_ports ctrl_8bits] [get_bd_intf_pins axi_gpio_8/GPIO]
connect_bd_intf_net [get_bd_intf_pins ps8_0_axi_periph/M00_AXI] [get_bd_intf_pins axi_gpio_9/S_AXI]
connect_bd_intf_net [get_bd_intf_pins ps8_0_axi_periph/M01_AXI] [get_bd_intf_pins axi_gpio_1/S_AXI]
connect_bd_intf_net [get_bd_intf_pins ps8_0_axi_periph/M02_AXI] [get_bd_intf_pins axi_gpio_2/S_AXI]
connect_bd_intf_net [get_bd_intf_pins ps8_0_axi_periph/M03_AXI] [get_bd_intf_pins axi_gpio_3/S_AXI]
connect_bd_intf_net [get_bd_intf_pins ps8_0_axi_periph/M04_AXI] [get_bd_intf_pins axi_gpio_4/S_AXI]
connect_bd_intf_net [get_bd_intf_pins ps8_0_axi_periph/M05_AXI] [get_bd_intf_pins axi_gpio_10/S_AXI]
connect_bd_intf_net [get_bd_intf_pins ps8_0_axi_periph/M06_AXI] [get_bd_intf_pins axi_gpio_0/S_AXI]
connect_bd_intf_net [get_bd_intf_pins ps8_0_axi_periph/M07_AXI] [get_bd_intf_pins axi_gpio_7/S_AXI]
connect_bd_intf_net [get_bd_intf_pins ps8_0_axi_periph/M08_AXI] [get_bd_intf_pins axi_gpio_8/S_AXI]
connect_bd_intf_net [get_bd_intf_pins ps8_0_axi_periph/M09_AXI] [get_bd_intf_pins axi_iic_0/S_AXI]
connect_bd_intf_net [get_bd_intf_pins ps8_0_axi_periph/M10_AXI] [get_bd_intf_pins axi_quad_spi_0/AXI_LITE]
connect_bd_intf_net [get_bd_intf_pins ps8_0_axi_periph/M11_AXI] [get_bd_intf_pins axi_quad_spi_1/AXI_LITE]
connect_bd_intf_net [get_bd_intf_pins ps8_0_axi_periph/M12_AXI] [get_bd_intf_pins axi_gpio_5/S_AXI]
connect_bd_intf_net [get_bd_intf_pins ps8_0_axi_periph/M13_AXI] [get_bd_intf_pins axi_gpio_6/S_AXI]
connect_bd_intf_net [get_bd_intf_pins ps8_0_axi_periph/M14_AXI] [get_bd_intf_pins axi_gpio_11/S_AXI]
connect_bd_intf_net [get_bd_intf_pins ps8_0_axi_periph/M15_AXI] [get_bd_intf_pins axi_gpio_12/S_AXI]
connect_bd_intf_net [get_bd_intf_pins ps8_0_axi_periph/M16_AXI] [get_bd_intf_pins axi_gpio_13/S_AXI]
connect_bd_intf_net [get_bd_intf_pins ps8_0_axi_periph/M17_AXI] [get_bd_intf_pins axi_iic_1/S_AXI]
connect_bd_intf_net [get_bd_intf_pins ps8_0_axi_periph/M18_AXI] [get_bd_intf_pins axi_iic_2/S_AXI]
connect_bd_intf_net [get_bd_intf_pins ps8_0_axi_periph/M19_AXI] [get_bd_intf_pins axi_gpio_14/S_AXI]
connect_bd_intf_net [get_bd_intf_pins ps8_0_axi_periph/M20_AXI] [get_bd_intf_pins axi_gpio_15/S_AXI]
connect_bd_intf_net [get_bd_intf_pins ps8_0_axi_periph/M21_AXI] [get_bd_intf_pins axi_gpio_16/S_AXI]
connect_bd_intf_net [get_bd_intf_pins ps8_0_axi_periph/M22_AXI] [get_bd_intf_pins axi_gpio_17/S_AXI]
connect_bd_intf_net [get_bd_intf_pins ps8_0_axi_periph/M23_AXI] [get_bd_intf_pins axi_gpio_18/S_AXI]
connect_bd_intf_net [get_bd_intf_pins ps8_0_axi_periph/M24_AXI] [get_bd_intf_pins axi_gpio_22/S_AXI]
connect_bd_intf_net [get_bd_intf_pins ps8_0_axi_periph/M25_AXI] [get_bd_intf_pins axi_gpio_19/S_AXI]
connect_bd_intf_net [get_bd_intf_pins ps8_0_axi_periph/M26_AXI] [get_bd_intf_pins axi_gpio_20/S_AXI]
connect_bd_intf_net [get_bd_intf_pins ps8_0_axi_periph/M27_AXI] [get_bd_intf_pins axi_gpio_21/S_AXI]
connect_bd_intf_net [get_bd_intf_pins ps8_0_axi_periph/M28_AXI] [get_bd_intf_pins axi_gpio_23/S_AXI]
connect_bd_intf_net [get_bd_intf_pins ps8_0_axi_periph/M29_AXI] [get_bd_intf_pins axi_bram_ctrl_0/S_AXI]
connect_bd_intf_net [get_bd_intf_pins ps8_0_axi_periph/M30_AXI] [get_bd_intf_pins axi_bram_ctrl_1/S_AXI]
connect_bd_intf_net [get_bd_intf_pins zynq_ultra_ps_e_0/M_AXI_HPM0_LPD] [get_bd_intf_pins ps8_0_axi_periph/S00_AXI]
connect_bd_net [get_bd_pins ADC_CHA_Selector_0/ADC_DATA_OUT] [get_bd_pins axi_gpio_20/gpio_io_i] [get_bd_pins ila_2/probe3]
connect_bd_net [get_bd_pins ADC_CHA_Selector_0/ADC_DATA_OUT2] [get_bd_pins ila_2/probe4]
connect_bd_net [get_bd_pins ADC_CHA_Selector_1/ADC_DATA_OUT] [get_bd_pins axi_gpio_21/gpio_io_i] [get_bd_pins ila_1/probe3]
connect_bd_net [get_bd_pins ADC_CHA_Selector_1/ADC_DATA_OUT2] [get_bd_pins ila_1/probe4] [get_bd_pins FFT_to_GPIO_wrapper_1/realDataIn]
connect_bd_net [get_bd_pins ADC_CHA_Selector_2/ADC_DATA_OUT] [get_bd_pins axi_gpio_22/gpio_io_i] [get_bd_pins ila_0/probe3]
connect_bd_net [get_bd_pins ADC_CHA_Selector_2/ADC_DATA_OUT2] \
  [get_bd_pins ila_0/probe4] [get_bd_pins ila_3/probe2] [get_bd_pins FFT_to_GPIO_wrapper_0/realDataIn]
connect_bd_net [get_bd_pins ADC_CHA_Selector_3/ADC_DATA_OUT] [get_bd_pins axi_gpio_23/gpio_io_i] [get_bd_pins ila_0/probe8]
connect_bd_net [get_bd_pins ADC_CHB_selector_0/ADC_DATA_OUT] [get_bd_pins axi_gpio_20/gpio2_io_i] [get_bd_pins ila_2/probe1]
connect_bd_net [get_bd_pins ADC_CHB_selector_0/ADC_DATA_OUT2] [get_bd_pins ila_2/probe2]
connect_bd_net [get_bd_pins ADC_CHB_selector_1/ADC_DATA_OUT] [get_bd_pins axi_gpio_21/gpio2_io_i] [get_bd_pins ila_1/probe1]
connect_bd_net [get_bd_pins ADC_CHB_selector_1/ADC_DATA_OUT2] [get_bd_pins ila_1/probe2] [get_bd_pins FFT_to_GPIO_wrapper_1/ImgnDataIn]
connect_bd_net [get_bd_pins ADC_CHB_selector_2/ADC_DATA_OUT] [get_bd_pins axi_gpio_22/gpio2_io_i] [get_bd_pins ila_0/probe1]
connect_bd_net [get_bd_pins ADC_CHB_selector_2/ADC_DATA_OUT2] \
  [get_bd_pins ila_0/probe2] [get_bd_pins ila_3/probe1] [get_bd_pins FFT_to_GPIO_wrapper_0/ImgnDataIn]
connect_bd_net [get_bd_pins ADC_CHB_selector_3/ADC_DATA_OUT] [get_bd_pins axi_gpio_23/gpio2_io_i] [get_bd_pins ila_0/probe9]
connect_bd_net [get_bd_pins ADC_MinMax_0/CHAMAX_OUT] [get_bd_pins axi_gpio_2/gpio_io_i]
connect_bd_net -net ADC_MinMax_0_CHAMAX_OUT1 [get_bd_pins ADC_MinMax_1/CHAMAX_OUT] [get_bd_pins axi_gpio_4/gpio_io_i]
connect_bd_net -net ADC_MinMax_0_CHAMAX_OUT2 [get_bd_pins ADC_MinMax_2/CHAMAX_OUT] [get_bd_pins axi_gpio_6/gpio_io_i]
connect_bd_net -net ADC_MinMax_0_CHAMAX_OUT3 [get_bd_pins ADC_MinMax_3/CHAMAX_OUT] [get_bd_pins axi_gpio_12/gpio_io_i]
connect_bd_net [get_bd_pins ADC_MinMax_0/CHAMIN_OUT] [get_bd_pins axi_gpio_2/gpio2_io_i]
connect_bd_net -net ADC_MinMax_0_CHAMIN_OUT1 [get_bd_pins ADC_MinMax_1/CHAMIN_OUT] [get_bd_pins axi_gpio_4/gpio2_io_i]
connect_bd_net -net ADC_MinMax_0_CHAMIN_OUT2 [get_bd_pins ADC_MinMax_2/CHAMIN_OUT] [get_bd_pins axi_gpio_6/gpio2_io_i]
connect_bd_net -net ADC_MinMax_0_CHAMIN_OUT3 [get_bd_pins ADC_MinMax_3/CHAMIN_OUT] [get_bd_pins axi_gpio_12/gpio2_io_i]
connect_bd_net [get_bd_pins ADC_MinMax_0/CHBMAX_OUT] [get_bd_pins axi_gpio_3/gpio_io_i]
connect_bd_net -net ADC_MinMax_0_CHBMAX_OUT1 [get_bd_pins ADC_MinMax_1/CHBMAX_OUT] [get_bd_pins axi_gpio_5/gpio_io_i]
connect_bd_net -net ADC_MinMax_0_CHBMAX_OUT2 [get_bd_pins ADC_MinMax_2/CHBMAX_OUT] [get_bd_pins axi_gpio_11/gpio_io_i]
connect_bd_net -net ADC_MinMax_0_CHBMAX_OUT3 [get_bd_pins ADC_MinMax_3/CHBMAX_OUT] [get_bd_pins axi_gpio_13/gpio_io_i]
connect_bd_net [get_bd_pins ADC_MinMax_0/CHBMIN_OUT] [get_bd_pins axi_gpio_3/gpio2_io_i]
connect_bd_net -net ADC_MinMax_0_CHBMIN_OUT1 [get_bd_pins ADC_MinMax_1/CHBMIN_OUT] [get_bd_pins axi_gpio_5/gpio2_io_i]
connect_bd_net -net ADC_MinMax_0_CHBMIN_OUT2 [get_bd_pins ADC_MinMax_2/CHBMIN_OUT] [get_bd_pins axi_gpio_11/gpio2_io_i]
connect_bd_net -net ADC_MinMax_0_CHBMIN_OUT3 [get_bd_pins ADC_MinMax_3/CHBMIN_OUT] [get_bd_pins axi_gpio_13/gpio2_io_i]
connect_bd_net [get_bd_pins ClockDivider_0/CLKOUT] \
  [get_bd_pins DAC_CTRL_0/CLKIN] [get_bd_pins DAC_CTRL_1/CLKIN] [get_bd_pins DAC_CTRL_2/CLKIN] [get_bd_pins DAC_CTRL_3/CLKIN]
connect_bd_net [get_bd_pins DAC_CTRL_0/DACDATA] [get_bd_pins util_ds_buf_6/IOBUF_IO_I]
connect_bd_net [get_bd_pins DAC_CTRL_0/DCKOUT] [get_bd_pins util_ds_buf_15/IOBUF_IO_I]
connect_bd_net [get_bd_pins DAC_CTRL_1/DACDATA] [get_bd_pins util_ds_buf_7/IOBUF_IO_I]
connect_bd_net [get_bd_pins DAC_CTRL_1/DCKOUT] [get_bd_pins util_ds_buf_16/IOBUF_IO_I]
connect_bd_net [get_bd_pins DAC_CTRL_2/DACDATA] [get_bd_pins util_ds_buf_8/IOBUF_IO_I]
connect_bd_net [get_bd_pins DAC_CTRL_2/DCKOUT] [get_bd_pins util_ds_buf_17/IOBUF_IO_I]
connect_bd_net [get_bd_pins DAC_CTRL_3/DACDATA] [get_bd_pins util_ds_buf_9/IOBUF_IO_I]
connect_bd_net [get_bd_pins DAC_CTRL_3/DCKOUT] [get_bd_pins util_ds_buf_18/IOBUF_IO_I]
connect_bd_net [get_bd_pins FFT_to_GPIO_wrapper_0/BRAM_addr] [get_bd_pins blk_mem_gen_0/addra] [get_bd_pins ila_0/probe6]
connect_bd_net -net FFT_to_GPIO_wrapper_0_BRAM_addr1 [get_bd_pins FFT_to_GPIO_wrapper_1/BRAM_addr] \
  [get_bd_pins blk_mem_gen_1/addra] [get_bd_pins ila_0/probe7]
connect_bd_net [get_bd_pins FFT_to_GPIO_wrapper_0/BRAM_data] [get_bd_pins blk_mem_gen_0/dina] [get_bd_pins ila_3/probe0]
connect_bd_net -net FFT_to_GPIO_wrapper_0_BRAM_data1 [get_bd_pins FFT_to_GPIO_wrapper_1/BRAM_data] [get_bd_pins blk_mem_gen_1/dina]
connect_bd_net [get_bd_pins FFT_to_GPIO_wrapper_0/BRAM_ena] [get_bd_pins blk_mem_gen_0/ena]
connect_bd_net -net FFT_to_GPIO_wrapper_0_BRAM_ena1 [get_bd_pins FFT_to_GPIO_wrapper_1/BRAM_ena] [get_bd_pins blk_mem_gen_1/ena]
connect_bd_net [get_bd_pins FFT_to_GPIO_wrapper_0/BRAM_wea] [get_bd_pins blk_mem_gen_0/wea]
connect_bd_net -net FFT_to_GPIO_wrapper_0_BRAM_wea1 [get_bd_pins FFT_to_GPIO_wrapper_1/BRAM_wea] [get_bd_pins blk_mem_gen_1/wea]
connect_bd_net [get_bd_ports IOBUF_SE_32_37] [get_bd_pins util_ds_buf_10/IOBUF_IO_IO]
connect_bd_net [get_bd_ports IOBUF_SE_0_31] [get_bd_pins util_ds_buf_12/IOBUF_IO_IO]
connect_bd_net [get_bd_ports IOBUF_DS_0_21_p] [get_bd_pins util_ds_buf_14/IOBUF_IO_IO]
connect_bd_net [get_bd_ports IOBUF_DS_0_21_n] [get_bd_pins util_ds_buf_13/IOBUF_IO_IO]
connect_bd_net [get_bd_ports IOBUF_CLK3] [get_bd_pins util_ds_buf_18/IOBUF_IO_IO]
connect_bd_net [get_bd_ports IOBUF_DATA1] [get_bd_pins util_ds_buf_7/IOBUF_IO_IO]
connect_bd_net [get_bd_ports IOBUF_CLK2] [get_bd_pins util_ds_buf_17/IOBUF_IO_IO]
connect_bd_net [get_bd_ports IOBUF_CLK1] [get_bd_pins util_ds_buf_16/IOBUF_IO_IO]
connect_bd_net [get_bd_ports IOBUF_DATA2] [get_bd_pins util_ds_buf_8/IOBUF_IO_IO]
connect_bd_net [get_bd_ports IOBUF_DATA3] [get_bd_pins util_ds_buf_9/IOBUF_IO_IO]
connect_bd_net [get_bd_ports IOBUF_CLK0] [get_bd_pins util_ds_buf_15/IOBUF_IO_IO]
connect_bd_net [get_bd_ports IOBUF_DATA0] [get_bd_pins util_ds_buf_6/IOBUF_IO_IO]
connect_bd_net [get_bd_ports IOBUF_SDA_0] [get_bd_pins util_ds_buf_0/IOBUF_IO_IO]
connect_bd_net [get_bd_ports IOBUF_SCL_0] [get_bd_pins util_ds_buf_1/IOBUF_IO_IO]
connect_bd_net [get_bd_ports IOBUF_SDA_1] [get_bd_pins util_ds_buf_2/IOBUF_IO_IO]
connect_bd_net [get_bd_ports IOBUF_SCL_1] [get_bd_pins util_ds_buf_3/IOBUF_IO_IO]
connect_bd_net [get_bd_ports IOBUF_SDA_2] [get_bd_pins util_ds_buf_4/IOBUF_IO_IO]
connect_bd_net [get_bd_ports IOBUF_SCL_2] [get_bd_pins util_ds_buf_5/IOBUF_IO_IO]
connect_bd_net [get_bd_pins xlslice_0/Dout] \
  [get_bd_pins xlconcat_0/In1] [get_bd_pins xlconcat_0/In0] [get_bd_pins xlconcat_0/In2] [get_bd_pins xlconcat_0/In3] \
  [get_bd_pins xlconcat_0/In4] [get_bd_pins xlconcat_0/In5] [get_bd_pins xlconcat_0/In6] [get_bd_pins xlconcat_0/In7] \
  [get_bd_pins xlconcat_0/In8] [get_bd_pins xlconcat_0/In9] [get_bd_pins xlconcat_0/In10] [get_bd_pins xlconcat_0/In11] \
  [get_bd_pins util_ds_buf_15/IOBUF_IO_T]
connect_bd_net [get_bd_pins xlslice_1/Dout] \
  [get_bd_pins xlconcat_1/In1] [get_bd_pins xlconcat_1/In0] [get_bd_pins xlconcat_1/In2] [get_bd_pins xlconcat_1/In3] \
  [get_bd_pins xlconcat_1/In4] [get_bd_pins xlconcat_1/In5] [get_bd_pins xlconcat_1/In6] [get_bd_pins xlconcat_1/In7] \
  [get_bd_pins xlconcat_1/In8] [get_bd_pins xlconcat_1/In9] [get_bd_pins xlconcat_1/In10] [get_bd_pins xlconcat_1/In11] \
  [get_bd_pins util_ds_buf_16/IOBUF_IO_T]
connect_bd_net [get_bd_pins xlslice_2/Dout] \
  [get_bd_pins xlconcat_2/In1] [get_bd_pins xlconcat_2/In0] [get_bd_pins xlconcat_2/In2] [get_bd_pins xlconcat_2/In3] \
  [get_bd_pins xlconcat_2/In4] [get_bd_pins xlconcat_2/In5] [get_bd_pins xlconcat_2/In6] [get_bd_pins xlconcat_2/In7] \
  [get_bd_pins xlconcat_2/In8] [get_bd_pins xlconcat_2/In9] [get_bd_pins xlconcat_2/In10] [get_bd_pins xlconcat_2/In11] \
  [get_bd_pins util_ds_buf_17/IOBUF_IO_T]
connect_bd_net [get_bd_pins xlslice_3/Dout] \
  [get_bd_pins xlconcat_3/In1] [get_bd_pins xlconcat_3/In0] [get_bd_pins xlconcat_3/In2] [get_bd_pins xlconcat_3/In3] \
  [get_bd_pins xlconcat_3/In4] [get_bd_pins xlconcat_3/In5] [get_bd_pins xlconcat_3/In6] [get_bd_pins xlconcat_3/In7] \
  [get_bd_pins xlconcat_3/In8] [get_bd_pins xlconcat_3/In9] [get_bd_pins xlconcat_3/In10] [get_bd_pins xlconcat_3/In11] \
  [get_bd_pins util_ds_buf_18/IOBUF_IO_T]
connect_bd_net [get_bd_pins ClockDivider_1/CLKOUT] [get_bd_pins util_vector_logic_0/Op1] [get_bd_pins util_ds_buf_11/BUFG_I]
connect_bd_net [get_bd_pins xlslice_11/Dout] \
  [get_bd_pins DAC_CTRL_2/CONSTMODE] [get_bd_pins DAC_CTRL_1/CONSTMODE] [get_bd_pins DAC_CTRL_0/CONSTMODE] \
  [get_bd_pins DAC_CTRL_3/CONSTMODE]
connect_bd_net [get_bd_pins axi_gpio_9/gpio2_io_o] \
  [get_bd_pins xlslice_4/Din] [get_bd_pins xlslice_5/Din] [get_bd_pins xlslice_6/Din] [get_bd_pins xlslice_7/Din] \
  [get_bd_pins xlslice_8/Din] [get_bd_pins xlslice_9/Din]
connect_bd_net [get_bd_pins xlslice_10/Dout] [get_bd_pins util_vector_logic_4/Op1] [get_bd_pins util_vector_logic_1/Op2]
connect_bd_net [get_bd_pins axi_gpio_8/gpio2_io_o] [get_bd_pins xlslice_11/Din] [get_bd_pins xlslice_10/Din]
connect_bd_net [get_bd_pins clk_wiz_0/clk_out2] \
  [get_bd_pins blk_mem_gen_0/clka] [get_bd_pins blk_mem_gen_1/clka] [get_bd_pins FFT_to_GPIO_wrapper_0/rd_clk_10mhz] \
  [get_bd_pins FFT_to_GPIO_wrapper_1/rd_clk_10mhz]
connect_bd_net [get_bd_pins clk_wiz_0/clk_out5] \
  [get_bd_pins FFT_to_GPIO_wrapper_0/sample_clk_65mhz] [get_bd_pins FFT_to_GPIO_wrapper_1/sample_clk_65mhz]
connect_bd_net [get_bd_pins SoftwareOverride_0/Output_Y] [get_bd_pins util_vector_logic_1/Op1]
connect_bd_net -net axi_gpio_0_gpio_io_o [get_bd_pins axi_gpio_9/gpio_io_o] [get_bd_pins util_ds_buf_12/IOBUF_IO_I]
connect_bd_net -net axi_gpio_0_gpio_io_o1 [get_bd_pins axi_gpio_10/gpio_io_o] [get_bd_pins util_ds_buf_13/IOBUF_IO_I]
connect_bd_net -net axi_gpio_0_gpio_io_t [get_bd_pins axi_gpio_9/gpio_io_t] [get_bd_pins util_ds_buf_12/IOBUF_IO_T]
connect_bd_net -net axi_gpio_0_gpio_io_t1 [get_bd_pins axi_gpio_10/gpio_io_t] [get_bd_pins util_ds_buf_13/IOBUF_IO_T]
connect_bd_net [get_bd_pins axi_gpio_14/gpio_io_o] \
  [get_bd_pins xlslice_0/Din] [get_bd_pins xlslice_1/Din] [get_bd_pins xlslice_2/Din] [get_bd_pins xlslice_3/Din]
connect_bd_net [get_bd_pins axi_gpio_15/gpio2_io_o] [get_bd_pins DAC_CTRL_0/DATA_INB_MAX]
connect_bd_net [get_bd_pins axi_gpio_15/gpio_io_o] [get_bd_pins DAC_CTRL_0/DATA_INA_MIN]
connect_bd_net [get_bd_pins axi_gpio_16/gpio2_io_o] [get_bd_pins DAC_CTRL_1/DATA_INB_MAX]
connect_bd_net [get_bd_pins axi_gpio_16/gpio_io_o] [get_bd_pins DAC_CTRL_1/DATA_INA_MIN]
connect_bd_net [get_bd_pins axi_gpio_17/gpio2_io_o] [get_bd_pins DAC_CTRL_2/DATA_INB_MAX]
connect_bd_net [get_bd_pins axi_gpio_17/gpio_io_o] [get_bd_pins DAC_CTRL_2/DATA_INA_MIN]
connect_bd_net [get_bd_pins axi_gpio_18/gpio2_io_o] [get_bd_pins DAC_CTRL_3/DATA_INB_MAX]
connect_bd_net [get_bd_pins axi_gpio_18/gpio_io_o] [get_bd_pins DAC_CTRL_3/DATA_INA_MIN]
connect_bd_net [get_bd_pins axi_gpio_19/gpio2_io_o] [get_bd_pins SoftwareOverride_0/I_OffRate]
connect_bd_net [get_bd_pins axi_gpio_19/gpio_io_o] [get_bd_pins SoftwareOverride_0/I_OnRate]
connect_bd_net [get_bd_pins axi_gpio_1/gpio2_io_o] [get_bd_pins ClockDivider_1/counterVal]
connect_bd_net [get_bd_pins axi_gpio_1/gpio_io_o] [get_bd_pins ClockDivider_0/counterVal]
connect_bd_net -net axi_gpio_9_gpio2_io_o1 [get_bd_pins axi_gpio_10/gpio2_io_o] [get_bd_pins util_ds_buf_14/IOBUF_IO_I]
connect_bd_net [get_bd_pins axi_gpio_9/gpio2_io_t] [get_bd_pins util_ds_buf_10/IOBUF_IO_T]
connect_bd_net -net axi_gpio_9_gpio2_io_t1 [get_bd_pins axi_gpio_10/gpio2_io_t] [get_bd_pins util_ds_buf_14/IOBUF_IO_T]
connect_bd_net [get_bd_pins axi_iic_0/scl_o] [get_bd_pins util_ds_buf_1/IOBUF_IO_I]
connect_bd_net -net axi_iic_0_scl_o1 [get_bd_pins axi_iic_1/scl_o] [get_bd_pins util_ds_buf_3/IOBUF_IO_I]
connect_bd_net -net axi_iic_0_scl_o2 [get_bd_pins axi_iic_2/scl_o] [get_bd_pins util_ds_buf_5/IOBUF_IO_I]
connect_bd_net [get_bd_pins axi_iic_0/scl_t] [get_bd_pins util_ds_buf_1/IOBUF_IO_T]
connect_bd_net -net axi_iic_0_scl_t1 [get_bd_pins axi_iic_1/scl_t] [get_bd_pins util_ds_buf_3/IOBUF_IO_T]
connect_bd_net -net axi_iic_0_scl_t2 [get_bd_pins axi_iic_2/scl_t] [get_bd_pins util_ds_buf_5/IOBUF_IO_T]
connect_bd_net [get_bd_pins axi_iic_0/sda_o] [get_bd_pins util_ds_buf_0/IOBUF_IO_I]
connect_bd_net -net axi_iic_0_sda_o1 [get_bd_pins axi_iic_1/sda_o] [get_bd_pins util_ds_buf_2/IOBUF_IO_I]
connect_bd_net -net axi_iic_0_sda_o2 [get_bd_pins axi_iic_2/sda_o] [get_bd_pins util_ds_buf_4/IOBUF_IO_I]
connect_bd_net [get_bd_pins axi_iic_0/sda_t] [get_bd_pins util_ds_buf_0/IOBUF_IO_T]
connect_bd_net -net axi_iic_0_sda_t1 [get_bd_pins axi_iic_1/sda_t] [get_bd_pins util_ds_buf_2/IOBUF_IO_T]
connect_bd_net -net axi_iic_0_sda_t2 [get_bd_pins axi_iic_2/sda_t] [get_bd_pins util_ds_buf_4/IOBUF_IO_T]
connect_bd_net [get_bd_pins axi_quad_spi_0/io0_o] [get_bd_ports MOSI_0]
connect_bd_net [get_bd_pins axi_quad_spi_0/sck_o] [get_bd_ports SCK_0]
connect_bd_net [get_bd_pins axi_quad_spi_0/ss_o] [get_bd_ports SS_0_4bits]
connect_bd_net [get_bd_pins axi_quad_spi_1/io0_o] [get_bd_ports MOSI_1]
connect_bd_net [get_bd_pins axi_quad_spi_1/sck_o] [get_bd_ports SCK_1]
connect_bd_net [get_bd_pins axi_quad_spi_1/ss_o] [get_bd_ports SS_1_2bits]
connect_bd_net [get_bd_pins clk_wiz_0/clk_out1] \
  [get_bd_pins ClockDivider_1/CLKIN] [get_bd_pins ila_0/clk] [get_bd_pins ila_1/clk] [get_bd_pins ila_2/clk] \
  [get_bd_pins ila_3/clk]
connect_bd_net [get_bd_pins clk_wiz_0/clk_out3] \
  [get_bd_pins ClockDivider_0/CLKIN] [get_bd_pins ADC_MinMax_0/CLKIN] [get_bd_pins ADC_MinMax_2/CLKIN] \
  [get_bd_pins ADC_MinMax_3/CLKIN] [get_bd_pins ADC_MinMax_1/CLKIN]
connect_bd_net [get_bd_pins clk_wiz_0/clk_out4] [get_bd_pins SoftwareOverride_0/I_CLK]
connect_bd_net -net io1_i_0_1 [get_bd_ports MISO_0] [get_bd_pins axi_quad_spi_0/io1_i]
connect_bd_net -net io1_i_1_1 [get_bd_ports MISO_1] [get_bd_pins axi_quad_spi_1/io1_i]
